# EAGLE schematic fp_32_v1 (EAGLE 8.4.1)

## Sheet 1 of 14
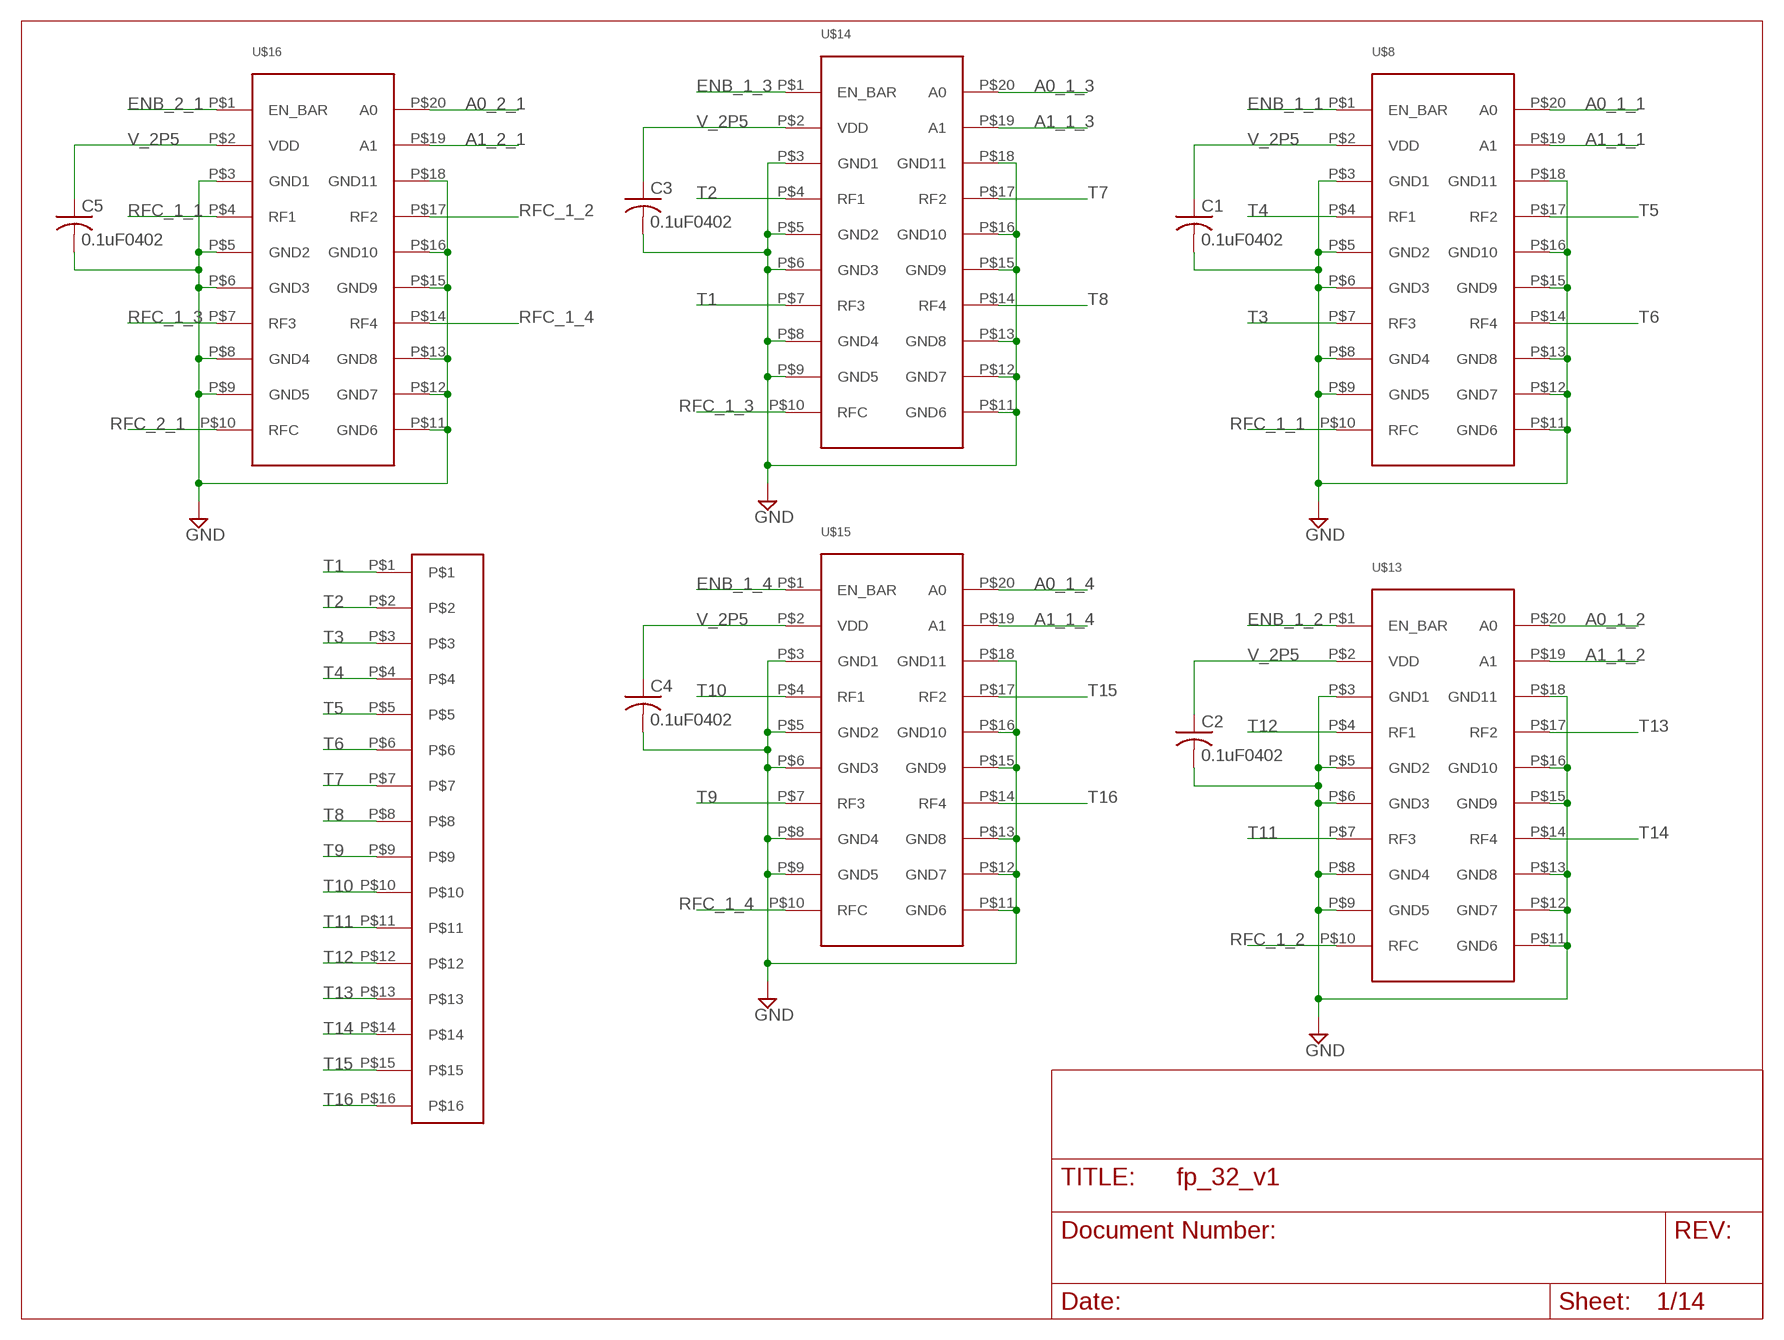
[diagram p0: schematic, sheet 1]

### Parts
C1  0.1uF0402  C-USC0402  [C0402]
C2  0.1uF0402  C-USC0402  [C0402]
C3  0.1uF0402  C-USC0402  [C0402]
C4  0.1uF0402  C-USC0402  [C0402]
C5  0.1uF0402  C-USC0402  [C0402]
U$2  FP-BOND-6MIL  [FP_BOND_6MIL]
U$8  TICLIB2_ADG904  [TICLIB2_ADG904_TSSOP]
U$13  TICLIB2_ADG904  [TICLIB2_ADG904_TSSOP]
U$14  TICLIB2_ADG904  [TICLIB2_ADG904_TSSOP]
U$15  TICLIB2_ADG904  [TICLIB2_ADG904_TSSOP]
U$16  TICLIB2_ADG904  [TICLIB2_ADG904_TSSOP]

### Nets
A0_1_1: U$8.P$20(A0) ; also sheet 5,6
A0_1_2: U$13.P$20(A0) ; also sheet 5,6
A0_1_3: U$14.P$20(A0) ; also sheet 5,6
A0_1_4: U$15.P$20(A0) ; also sheet 5,6
A0_2_1: U$16.P$20(A0) ; also sheet 6
A1_1_1: U$8.P$19(A1) ; also sheet 7
A1_1_2: U$13.P$19(A1) ; also sheet 7
A1_1_3: U$14.P$19(A1) ; also sheet 7
A1_1_4: U$15.P$19(A1) ; also sheet 7
A1_2_1: U$16.P$19(A1) ; also sheet 7
ENB_1_1: U$8.P$1(EN_BAR) ; also sheet 8
ENB_1_2: U$13.P$1(EN_BAR) ; also sheet 8
ENB_1_3: U$14.P$1(EN_BAR) ; also sheet 8
ENB_1_4: U$15.P$1(EN_BAR) ; also sheet 8
ENB_2_1: U$16.P$1(EN_BAR) ; also sheet 8
GND: C1.2 C2.2 C3.2 C4.2 C5.2 U$8.P$3(GND1) U$8.P$5(GND2) U$8.P$6(GND3) U$8.P$8(GND4) U$8.P$9(GND5) U$8.P$11(GND6) U$8.P$12(GND7) U$8.P$13(GND8) U$8.P$15(GND9) U$8.P$16(GND10) U$8.P$18(GND11) U$13.P$3(GND1) U$13.P$5(GND2) U$13.P$6(GND3) U$13.P$8(GND4) U$13.P$9(GND5) U$13.P$11(GND6) U$13.P$12(GND7) U$13.P$13(GND8) U$13.P$15(GND9) U$13.P$16(GND10) U$13.P$18(GND11) U$14.P$3(GND1) U$14.P$5(GND2) U$14.P$6(GND3) U$14.P$8(GND4) U$14.P$9(GND5) U$14.P$11(GND6) U$14.P$12(GND7) U$14.P$13(GND8) U$14.P$15(GND9) U$14.P$16(GND10) U$14.P$18(GND11) U$15.P$3(GND1) U$15.P$5(GND2) U$15.P$6(GND3) U$15.P$8(GND4) U$15.P$9(GND5) U$15.P$11(GND6) U$15.P$12(GND7) U$15.P$13(GND8) U$15.P$15(GND9) U$15.P$16(GND10) U$15.P$18(GND11) U$16.P$3(GND1) U$16.P$5(GND2) U$16.P$6(GND3) U$16.P$8(GND4) U$16.P$9(GND5) U$16.P$11(GND6) U$16.P$12(GND7) U$16.P$13(GND8) U$16.P$15(GND9) U$16.P$16(GND10) U$16.P$18(GND11) ; also sheet 2,3,4,5,6,7,8,9,10,11,12,13,14
RFC_1_1: U$8.P$10(RFC) U$16.P$4(RF1)
RFC_1_2: U$13.P$10(RFC) U$16.P$17(RF2)
RFC_1_3: U$14.P$10(RFC) U$16.P$7(RF3)
RFC_1_4: U$15.P$10(RFC) U$16.P$14(RF4)
RFC_2_1: U$16.P$10(RFC) ; also sheet 5
T1: U$2.P$1 U$14.P$7(RF3)
T2: U$2.P$2 U$14.P$4(RF1)
T3: U$2.P$3 U$8.P$7(RF3)
T4: U$2.P$4 U$8.P$4(RF1)
T5: U$2.P$5 U$8.P$17(RF2)
T6: U$2.P$6 U$8.P$14(RF4)
T7: U$2.P$7 U$14.P$17(RF2)
T8: U$2.P$8 U$14.P$14(RF4)
T9: U$2.P$9 U$15.P$7(RF3)
T10: U$2.P$10 U$15.P$4(RF1)
T11: U$2.P$11 U$13.P$7(RF3)
T12: U$2.P$12 U$13.P$4(RF1)
T13: U$2.P$13 U$13.P$17(RF2)
T14: U$2.P$14 U$13.P$14(RF4)
T15: U$2.P$15 U$15.P$17(RF2)
T16: U$2.P$16 U$15.P$14(RF4)
V_2P5: C1.1 C2.1 C3.1 C4.1 C5.1 U$8.P$2(VDD) U$13.P$2(VDD) U$14.P$2(VDD) U$15.P$2(VDD) U$16.P$2(VDD) ; also sheet 2,3,4,5,13

## Sheet 2 of 14
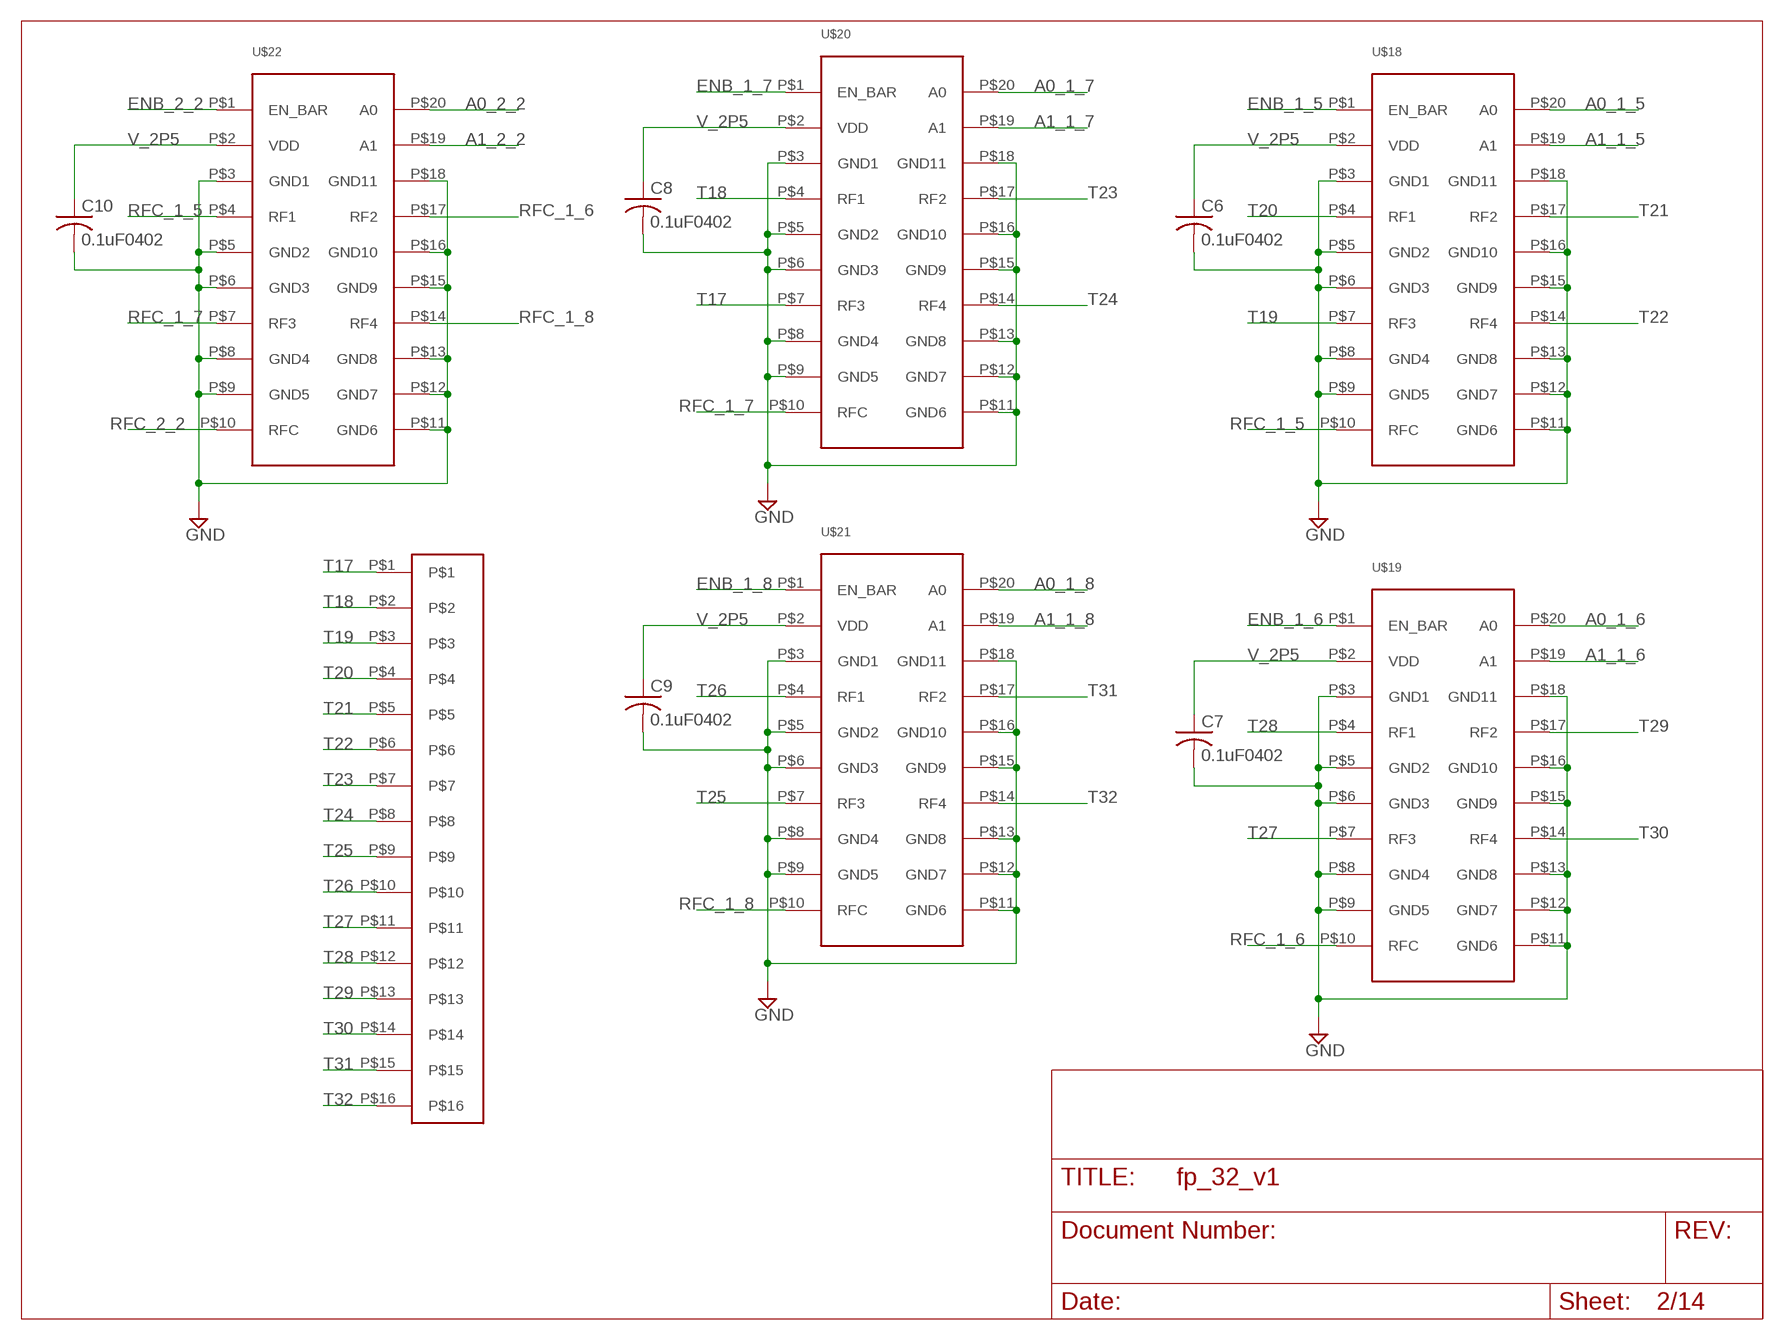
[diagram p1: schematic, sheet 2]

### Parts
C6  0.1uF0402  C-USC0402  [C0402]
C7  0.1uF0402  C-USC0402  [C0402]
C8  0.1uF0402  C-USC0402  [C0402]
C9  0.1uF0402  C-USC0402  [C0402]
C10  0.1uF0402  C-USC0402  [C0402]
U$17  FP-BOND-6MIL  [FP_BOND_6MIL]
U$18  TICLIB2_ADG904  [TICLIB2_ADG904_TSSOP]
U$19  TICLIB2_ADG904  [TICLIB2_ADG904_TSSOP]
U$20  TICLIB2_ADG904  [TICLIB2_ADG904_TSSOP]
U$21  TICLIB2_ADG904  [TICLIB2_ADG904_TSSOP]
U$22  TICLIB2_ADG904  [TICLIB2_ADG904_TSSOP]

### Nets
A0_1_5: U$18.P$20(A0) ; also sheet 5,6
A0_1_6: U$19.P$20(A0) ; also sheet 5,6
A0_1_7: U$20.P$20(A0) ; also sheet 5,6
A0_1_8: U$21.P$20(A0) ; also sheet 5,6
A0_2_2: U$22.P$20(A0) ; also sheet 6
A1_1_5: U$18.P$19(A1) ; also sheet 7
A1_1_6: U$19.P$19(A1) ; also sheet 7
A1_1_7: U$20.P$19(A1) ; also sheet 7
A1_1_8: U$21.P$19(A1) ; also sheet 7
A1_2_2: U$22.P$19(A1) ; also sheet 7
ENB_1_5: U$18.P$1(EN_BAR) ; also sheet 8
ENB_1_6: U$19.P$1(EN_BAR) ; also sheet 8
ENB_1_7: U$20.P$1(EN_BAR) ; also sheet 8
ENB_1_8: U$21.P$1(EN_BAR) ; also sheet 8
ENB_2_2: U$22.P$1(EN_BAR) ; also sheet 8
GND: C6.2 C7.2 C8.2 C9.2 C10.2 U$18.P$3(GND1) U$18.P$5(GND2) U$18.P$6(GND3) U$18.P$8(GND4) U$18.P$9(GND5) U$18.P$11(GND6) U$18.P$12(GND7) U$18.P$13(GND8) U$18.P$15(GND9) U$18.P$16(GND10) U$18.P$18(GND11) U$19.P$3(GND1) U$19.P$5(GND2) U$19.P$6(GND3) U$19.P$8(GND4) U$19.P$9(GND5) U$19.P$11(GND6) U$19.P$12(GND7) U$19.P$13(GND8) U$19.P$15(GND9) U$19.P$16(GND10) U$19.P$18(GND11) U$20.P$3(GND1) U$20.P$5(GND2) U$20.P$6(GND3) U$20.P$8(GND4) U$20.P$9(GND5) U$20.P$11(GND6) U$20.P$12(GND7) U$20.P$13(GND8) U$20.P$15(GND9) U$20.P$16(GND10) U$20.P$18(GND11) U$21.P$3(GND1) U$21.P$5(GND2) U$21.P$6(GND3) U$21.P$8(GND4) U$21.P$9(GND5) U$21.P$11(GND6) U$21.P$12(GND7) U$21.P$13(GND8) U$21.P$15(GND9) U$21.P$16(GND10) U$21.P$18(GND11) U$22.P$3(GND1) U$22.P$5(GND2) U$22.P$6(GND3) U$22.P$8(GND4) U$22.P$9(GND5) U$22.P$11(GND6) U$22.P$12(GND7) U$22.P$13(GND8) U$22.P$15(GND9) U$22.P$16(GND10) U$22.P$18(GND11) ; also sheet 1,3,4,5,6,7,8,9,10,11,12,13,14
RFC_1_5: U$18.P$10(RFC) U$22.P$4(RF1)
RFC_1_6: U$19.P$10(RFC) U$22.P$17(RF2)
RFC_1_7: U$20.P$10(RFC) U$22.P$7(RF3)
RFC_1_8: U$21.P$10(RFC) U$22.P$14(RF4)
RFC_2_2: U$22.P$10(RFC) ; also sheet 5
T17: U$17.P$1 U$20.P$7(RF3)
T18: U$17.P$2 U$20.P$4(RF1)
T19: U$17.P$3 U$18.P$7(RF3)
T20: U$17.P$4 U$18.P$4(RF1)
T21: U$17.P$5 U$18.P$17(RF2)
T22: U$17.P$6 U$18.P$14(RF4)
T23: U$17.P$7 U$20.P$17(RF2)
T24: U$17.P$8 U$20.P$14(RF4)
T25: U$17.P$9 U$21.P$7(RF3)
T26: U$17.P$10 U$21.P$4(RF1)
T27: U$17.P$11 U$19.P$7(RF3)
T28: U$17.P$12 U$19.P$4(RF1)
T29: U$17.P$13 U$19.P$17(RF2)
T30: U$17.P$14 U$19.P$14(RF4)
T31: U$17.P$15 U$21.P$17(RF2)
T32: U$17.P$16 U$21.P$14(RF4)
V_2P5: C6.1 C7.1 C8.1 C9.1 C10.1 U$18.P$2(VDD) U$19.P$2(VDD) U$20.P$2(VDD) U$21.P$2(VDD) U$22.P$2(VDD) ; also sheet 1,3,4,5,13

## Sheet 3 of 14
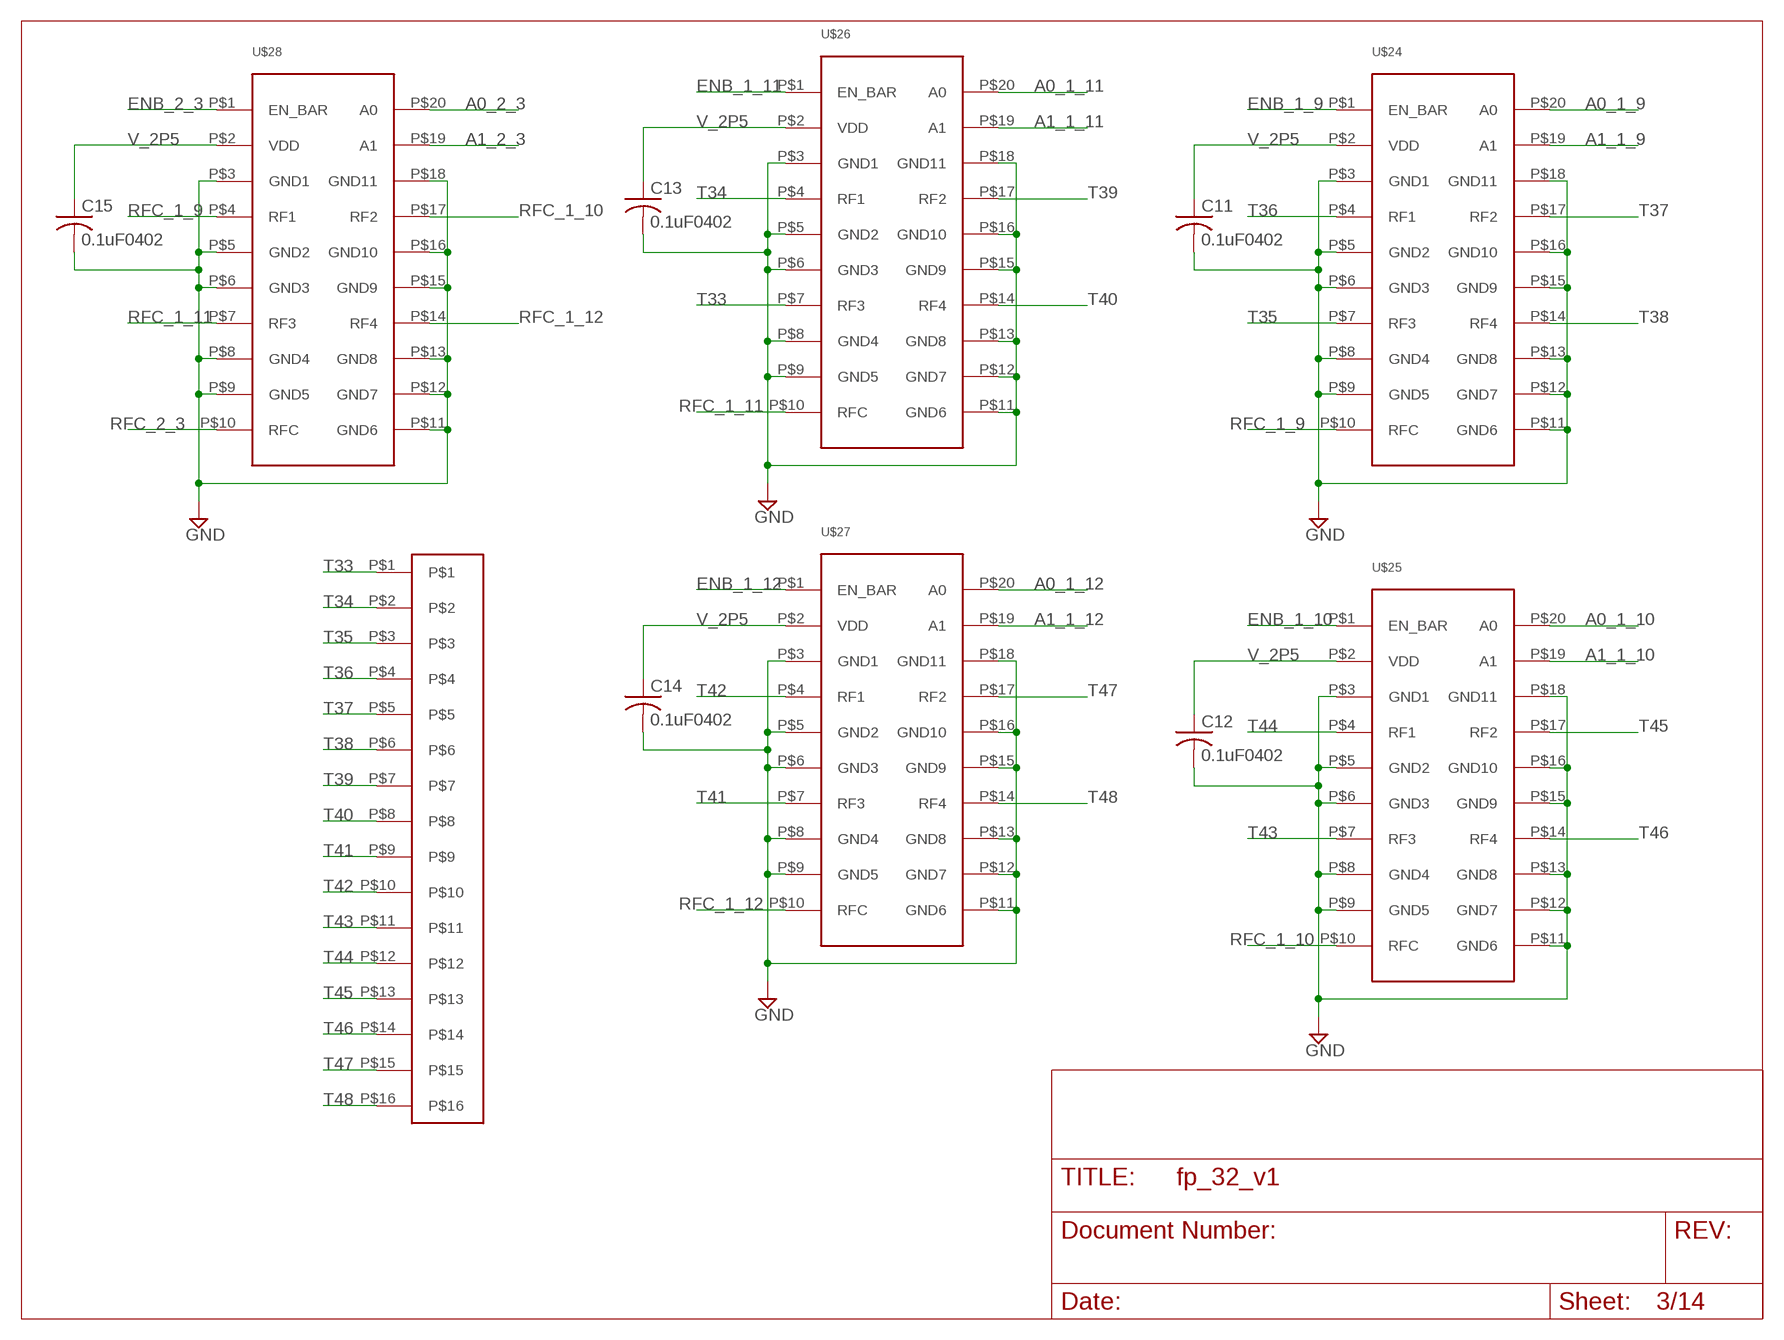
[diagram p2: schematic, sheet 3]

### Parts
C11  0.1uF0402  C-USC0402  [C0402]
C12  0.1uF0402  C-USC0402  [C0402]
C13  0.1uF0402  C-USC0402  [C0402]
C14  0.1uF0402  C-USC0402  [C0402]
C15  0.1uF0402  C-USC0402  [C0402]
U$23  FP-BOND-6MIL  [FP_BOND_6MIL]
U$24  TICLIB2_ADG904  [TICLIB2_ADG904_TSSOP]
U$25  TICLIB2_ADG904  [TICLIB2_ADG904_TSSOP]
U$26  TICLIB2_ADG904  [TICLIB2_ADG904_TSSOP]
U$27  TICLIB2_ADG904  [TICLIB2_ADG904_TSSOP]
U$28  TICLIB2_ADG904  [TICLIB2_ADG904_TSSOP]

### Nets
A0_1_9: U$24.P$20(A0) ; also sheet 5,6
A0_1_10: U$25.P$20(A0) ; also sheet 5,6
A0_1_11: U$26.P$20(A0) ; also sheet 5,6
A0_1_12: U$27.P$20(A0) ; also sheet 5,6
A0_2_3: U$28.P$20(A0) ; also sheet 6
A1_1_9: U$24.P$19(A1) ; also sheet 7
A1_1_10: U$25.P$19(A1) ; also sheet 7
A1_1_11: U$26.P$19(A1) ; also sheet 7
A1_1_12: U$27.P$19(A1) ; also sheet 7
A1_2_3: U$28.P$19(A1) ; also sheet 7
ENB_1_9: U$24.P$1(EN_BAR) ; also sheet 8
ENB_1_10: U$25.P$1(EN_BAR) ; also sheet 8
ENB_1_11: U$26.P$1(EN_BAR) ; also sheet 8
ENB_1_12: U$27.P$1(EN_BAR) ; also sheet 8
ENB_2_3: U$28.P$1(EN_BAR) ; also sheet 8
GND: C11.2 C12.2 C13.2 C14.2 C15.2 U$24.P$3(GND1) U$24.P$5(GND2) U$24.P$6(GND3) U$24.P$8(GND4) U$24.P$9(GND5) U$24.P$11(GND6) U$24.P$12(GND7) U$24.P$13(GND8) U$24.P$15(GND9) U$24.P$16(GND10) U$24.P$18(GND11) U$25.P$3(GND1) U$25.P$5(GND2) U$25.P$6(GND3) U$25.P$8(GND4) U$25.P$9(GND5) U$25.P$11(GND6) U$25.P$12(GND7) U$25.P$13(GND8) U$25.P$15(GND9) U$25.P$16(GND10) U$25.P$18(GND11) U$26.P$3(GND1) U$26.P$5(GND2) U$26.P$6(GND3) U$26.P$8(GND4) U$26.P$9(GND5) U$26.P$11(GND6) U$26.P$12(GND7) U$26.P$13(GND8) U$26.P$15(GND9) U$26.P$16(GND10) U$26.P$18(GND11) U$27.P$3(GND1) U$27.P$5(GND2) U$27.P$6(GND3) U$27.P$8(GND4) U$27.P$9(GND5) U$27.P$11(GND6) U$27.P$12(GND7) U$27.P$13(GND8) U$27.P$15(GND9) U$27.P$16(GND10) U$27.P$18(GND11) U$28.P$3(GND1) U$28.P$5(GND2) U$28.P$6(GND3) U$28.P$8(GND4) U$28.P$9(GND5) U$28.P$11(GND6) U$28.P$12(GND7) U$28.P$13(GND8) U$28.P$15(GND9) U$28.P$16(GND10) U$28.P$18(GND11) ; also sheet 1,2,4,5,6,7,8,9,10,11,12,13,14
RFC_1_9: U$24.P$10(RFC) U$28.P$4(RF1)
RFC_1_10: U$25.P$10(RFC) U$28.P$17(RF2)
RFC_1_11: U$26.P$10(RFC) U$28.P$7(RF3)
RFC_1_12: U$27.P$10(RFC) U$28.P$14(RF4)
RFC_2_3: U$28.P$10(RFC) ; also sheet 5
T33: U$23.P$1 U$26.P$7(RF3)
T34: U$23.P$2 U$26.P$4(RF1)
T35: U$23.P$3 U$24.P$7(RF3)
T36: U$23.P$4 U$24.P$4(RF1)
T37: U$23.P$5 U$24.P$17(RF2)
T38: U$23.P$6 U$24.P$14(RF4)
T39: U$23.P$7 U$26.P$17(RF2)
T40: U$23.P$8 U$26.P$14(RF4)
T41: U$23.P$9 U$27.P$7(RF3)
T42: U$23.P$10 U$27.P$4(RF1)
T43: U$23.P$11 U$25.P$7(RF3)
T44: U$23.P$12 U$25.P$4(RF1)
T45: U$23.P$13 U$25.P$17(RF2)
T46: U$23.P$14 U$25.P$14(RF4)
T47: U$23.P$15 U$27.P$17(RF2)
T48: U$23.P$16 U$27.P$14(RF4)
V_2P5: C11.1 C12.1 C13.1 C14.1 C15.1 U$24.P$2(VDD) U$25.P$2(VDD) U$26.P$2(VDD) U$27.P$2(VDD) U$28.P$2(VDD) ; also sheet 1,2,4,5,13

## Sheet 4 of 14
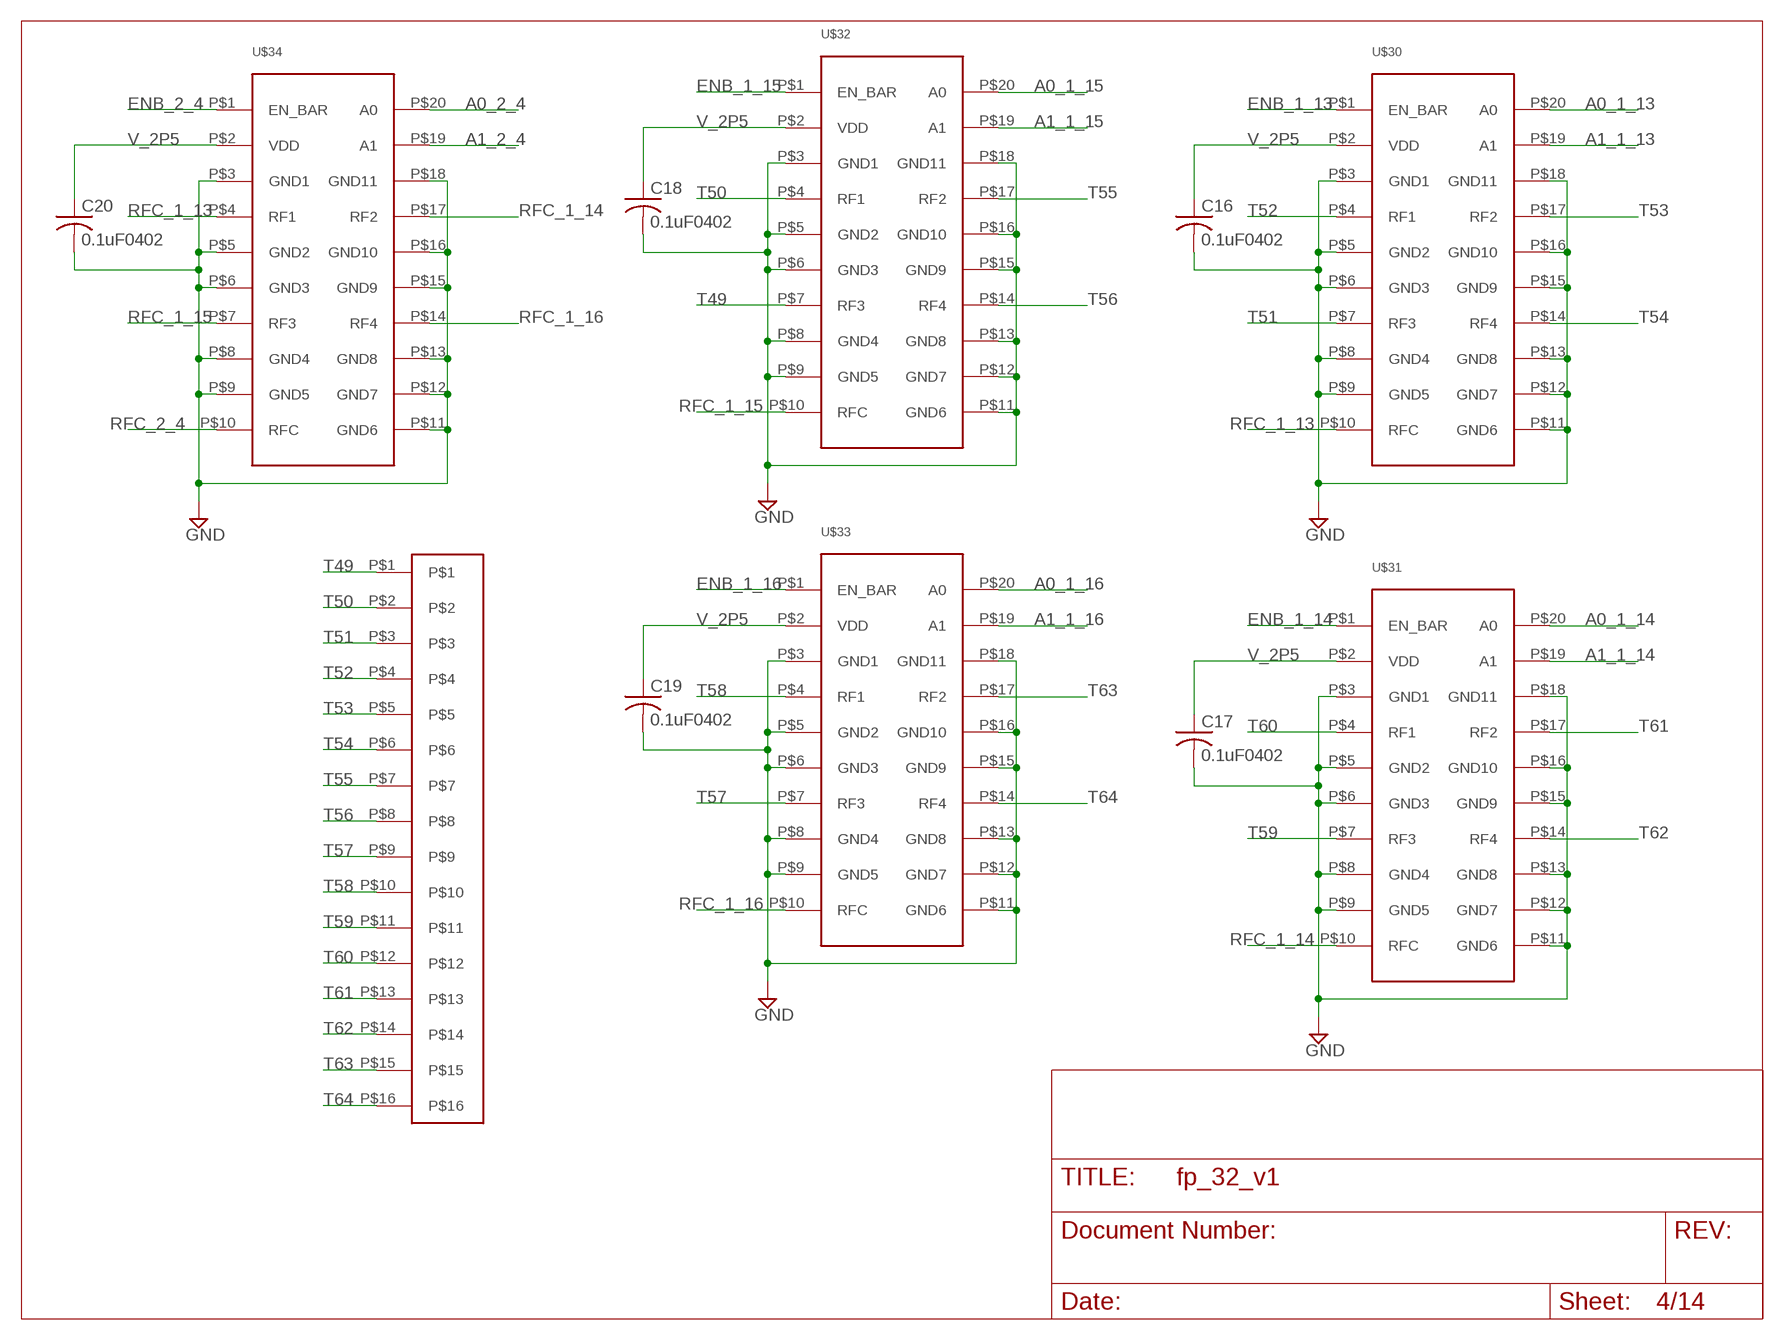
[diagram p3: schematic, sheet 4]

### Parts
C16  0.1uF0402  C-USC0402  [C0402]
C17  0.1uF0402  C-USC0402  [C0402]
C18  0.1uF0402  C-USC0402  [C0402]
C19  0.1uF0402  C-USC0402  [C0402]
C20  0.1uF0402  C-USC0402  [C0402]
U$29  FP-BOND-6MIL  [FP_BOND_6MIL]
U$30  TICLIB2_ADG904  [TICLIB2_ADG904_TSSOP]
U$31  TICLIB2_ADG904  [TICLIB2_ADG904_TSSOP]
U$32  TICLIB2_ADG904  [TICLIB2_ADG904_TSSOP]
U$33  TICLIB2_ADG904  [TICLIB2_ADG904_TSSOP]
U$34  TICLIB2_ADG904  [TICLIB2_ADG904_TSSOP]

### Nets
A0_1_13: U$30.P$20(A0) ; also sheet 5,6
A0_1_14: U$31.P$20(A0) ; also sheet 5,6
A0_1_15: U$32.P$20(A0) ; also sheet 5,6
A0_1_16: U$33.P$20(A0) ; also sheet 5,6
A0_2_4: U$34.P$20(A0) ; also sheet 6
A1_1_13: U$30.P$19(A1) ; also sheet 7
A1_1_14: U$31.P$19(A1) ; also sheet 7
A1_1_15: U$32.P$19(A1) ; also sheet 7
A1_1_16: U$33.P$19(A1) ; also sheet 7
A1_2_4: U$34.P$19(A1) ; also sheet 7
ENB_1_13: U$30.P$1(EN_BAR) ; also sheet 8
ENB_1_14: U$31.P$1(EN_BAR) ; also sheet 8
ENB_1_15: U$32.P$1(EN_BAR) ; also sheet 8
ENB_1_16: U$33.P$1(EN_BAR) ; also sheet 8
ENB_2_4: U$34.P$1(EN_BAR) ; also sheet 8
GND: C16.2 C17.2 C18.2 C19.2 C20.2 U$30.P$3(GND1) U$30.P$5(GND2) U$30.P$6(GND3) U$30.P$8(GND4) U$30.P$9(GND5) U$30.P$11(GND6) U$30.P$12(GND7) U$30.P$13(GND8) U$30.P$15(GND9) U$30.P$16(GND10) U$30.P$18(GND11) U$31.P$3(GND1) U$31.P$5(GND2) U$31.P$6(GND3) U$31.P$8(GND4) U$31.P$9(GND5) U$31.P$11(GND6) U$31.P$12(GND7) U$31.P$13(GND8) U$31.P$15(GND9) U$31.P$16(GND10) U$31.P$18(GND11) U$32.P$3(GND1) U$32.P$5(GND2) U$32.P$6(GND3) U$32.P$8(GND4) U$32.P$9(GND5) U$32.P$11(GND6) U$32.P$12(GND7) U$32.P$13(GND8) U$32.P$15(GND9) U$32.P$16(GND10) U$32.P$18(GND11) U$33.P$3(GND1) U$33.P$5(GND2) U$33.P$6(GND3) U$33.P$8(GND4) U$33.P$9(GND5) U$33.P$11(GND6) U$33.P$12(GND7) U$33.P$13(GND8) U$33.P$15(GND9) U$33.P$16(GND10) U$33.P$18(GND11) U$34.P$3(GND1) U$34.P$5(GND2) U$34.P$6(GND3) U$34.P$8(GND4) U$34.P$9(GND5) U$34.P$11(GND6) U$34.P$12(GND7) U$34.P$13(GND8) U$34.P$15(GND9) U$34.P$16(GND10) U$34.P$18(GND11) ; also sheet 1,2,3,5,6,7,8,9,10,11,12,13,14
RFC_1_13: U$30.P$10(RFC) U$34.P$4(RF1)
RFC_1_14: U$31.P$10(RFC) U$34.P$17(RF2)
RFC_1_15: U$32.P$10(RFC) U$34.P$7(RF3)
RFC_1_16: U$33.P$10(RFC) U$34.P$14(RF4)
RFC_2_4: U$34.P$10(RFC) ; also sheet 5
T49: U$29.P$1 U$32.P$7(RF3)
T50: U$29.P$2 U$32.P$4(RF1)
T51: U$29.P$3 U$30.P$7(RF3)
T52: U$29.P$4 U$30.P$4(RF1)
T53: U$29.P$5 U$30.P$17(RF2)
T54: U$29.P$6 U$30.P$14(RF4)
T55: U$29.P$7 U$32.P$17(RF2)
T56: U$29.P$8 U$32.P$14(RF4)
T57: U$29.P$9 U$33.P$7(RF3)
T58: U$29.P$10 U$33.P$4(RF1)
T59: U$29.P$11 U$31.P$7(RF3)
T60: U$29.P$12 U$31.P$4(RF1)
T61: U$29.P$13 U$31.P$17(RF2)
T62: U$29.P$14 U$31.P$14(RF4)
T63: U$29.P$15 U$33.P$17(RF2)
T64: U$29.P$16 U$33.P$14(RF4)
V_2P5: C16.1 C17.1 C18.1 C19.1 C20.1 U$30.P$2(VDD) U$31.P$2(VDD) U$32.P$2(VDD) U$33.P$2(VDD) U$34.P$2(VDD) ; also sheet 1,2,3,5,13

## Sheet 5 of 14
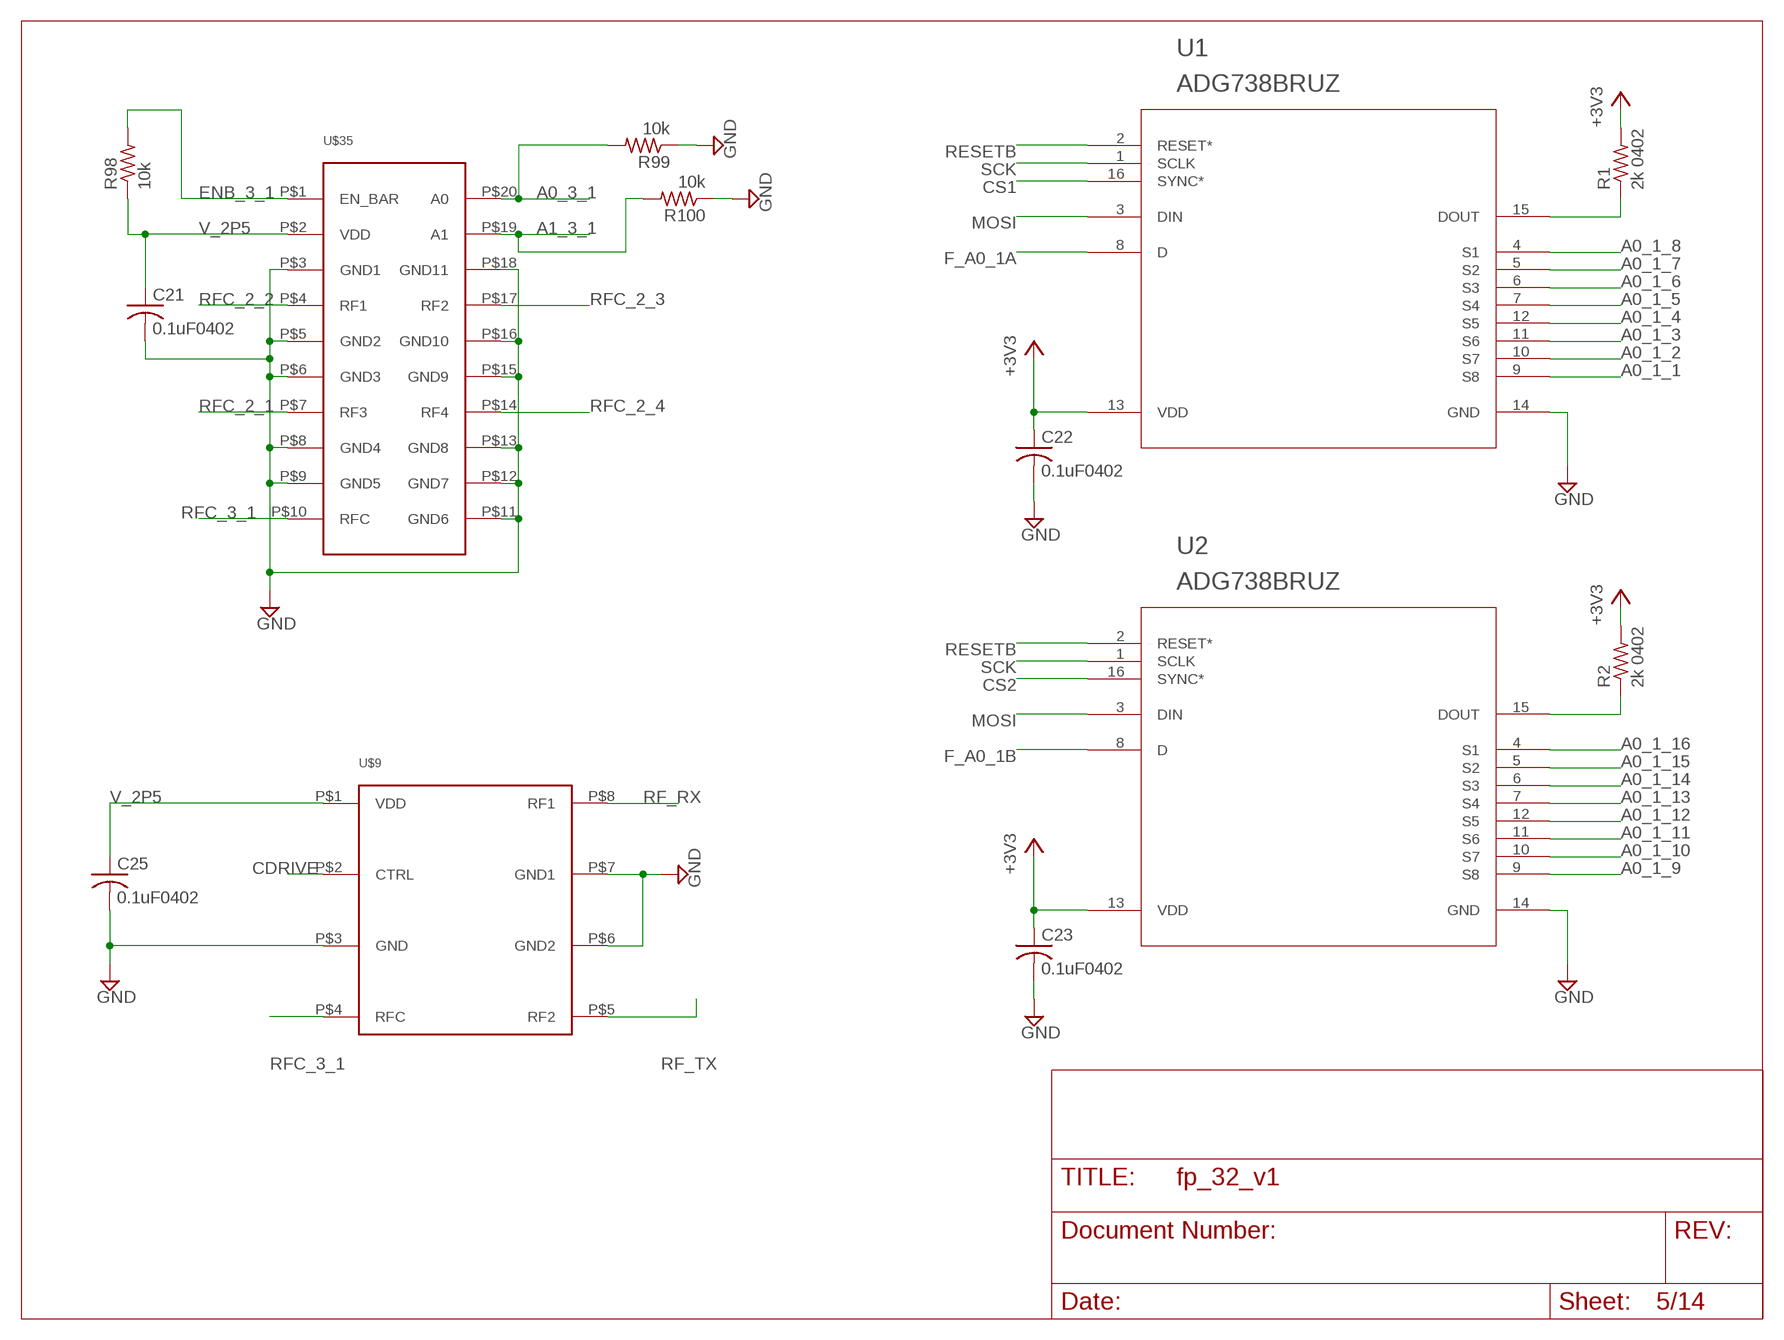
[diagram p4: schematic, sheet 5]

### Parts
C21  0.1uF0402  C-USC0402  [C0402]
C22  0.1uF0402  C-USC0402  [C0402]
C23  0.1uF0402  C-USC0402  [C0402]
C25  0.1uF0402  C-USC0402  [C0402]
R1  2k 0402  R-US_R0402  [R0402]
R2  2k 0402  R-US_R0402  [R0402]
R98  10k  R-US_R0402  [R0402]
R99  10k  R-US_R0402  [R0402]
R100  10k  R-US_R0402  [R0402]
U1  ADG738BRUZ  [RU_16]
U2  ADG738BRUZ  [RU_16]
U$9  TIC_TESTING_ADG918BRMZ-500RL7CT  [TIC_TESTING_ADG918BRMZ-500RL7CT-ND]
U$35  TICLIB2_ADG904  [TICLIB2_ADG904_TSSOP]

### Nets
+3V3: C22.1 C23.1 R1.2 R2.2 U1.13(VDD) U2.13(VDD) ; also sheet 6,7,8,13
A0_1_1: U1.9(S8) ; also sheet 1,6
A0_1_2: U1.10(S7) ; also sheet 1,6
A0_1_3: U1.11(S6) ; also sheet 1,6
A0_1_4: U1.12(S5) ; also sheet 1,6
A0_1_5: U1.7(S4) ; also sheet 2,6
A0_1_6: U1.6(S3) ; also sheet 2,6
A0_1_7: U1.5(S2) ; also sheet 2,6
A0_1_8: U1.4(S1) ; also sheet 2,6
A0_1_9: U2.9(S8) ; also sheet 3,6
A0_1_10: U2.10(S7) ; also sheet 3,6
A0_1_11: U2.11(S6) ; also sheet 3,6
A0_1_12: U2.12(S5) ; also sheet 3,6
A0_1_13: U2.7(S4) ; also sheet 4,6
A0_1_14: U2.6(S3) ; also sheet 4,6
A0_1_15: U2.5(S2) ; also sheet 4,6
A0_1_16: U2.4(S1) ; also sheet 4,6
A0_3_1: R99.2 U$35.P$20(A0) ; also sheet 14
A1_3_1: R100.2 U$35.P$19(A1) ; also sheet 14
CDRIVE: U$9.P$2(CTRL) ; also sheet 14
CS1: U1.16(SYNC*) ; also sheet 14
CS2: U2.16(SYNC*) ; also sheet 14
ENB_3_1: R98.2 U$35.P$1(EN_BAR) ; also sheet 14
F_A0_1A: U1.8(D) ; also sheet 14
F_A0_1B: U2.8(D) ; also sheet 14
GND: C21.2 C22.2 C23.2 C25.2 R99.1 R100.1 U1.14(GND) U2.14(GND) U$9.P$3(GND) U$9.P$6(GND2) U$9.P$7(GND1) U$35.P$3(GND1) U$35.P$5(GND2) U$35.P$6(GND3) U$35.P$8(GND4) U$35.P$9(GND5) U$35.P$11(GND6) U$35.P$12(GND7) U$35.P$13(GND8) U$35.P$15(GND9) U$35.P$16(GND10) U$35.P$18(GND11) ; also sheet 1,2,3,4,6,7,8,9,10,11,12,13,14
MOSI: U1.3(DIN) U2.3(DIN) ; also sheet 6,7,8,14
N$1: R1.1 U1.15(DOUT)
N$2: R2.1 U2.15(DOUT)
RESETB: U1.2(RESET*) U2.2(RESET*) ; also sheet 6,7,8,14
RF_RX: U$9.P$8(RF1) ; also sheet 6
RF_TX: U$9.P$5(RF2) ; also sheet 11
RFC_2_1: U$35.P$7(RF3) ; also sheet 1
RFC_2_2: U$35.P$4(RF1) ; also sheet 2
RFC_2_3: U$35.P$17(RF2) ; also sheet 3
RFC_2_4: U$35.P$14(RF4) ; also sheet 4
RFC_3_1: U$9.P$4(RFC) U$35.P$10(RFC)
SCK: U1.1(SCLK) U2.1(SCLK) ; also sheet 6,7,8,14
V_2P5: C21.1 C25.1 R98.1 U$9.P$1(VDD) U$35.P$2(VDD) ; also sheet 1,2,3,4,13

## Sheet 6 of 14
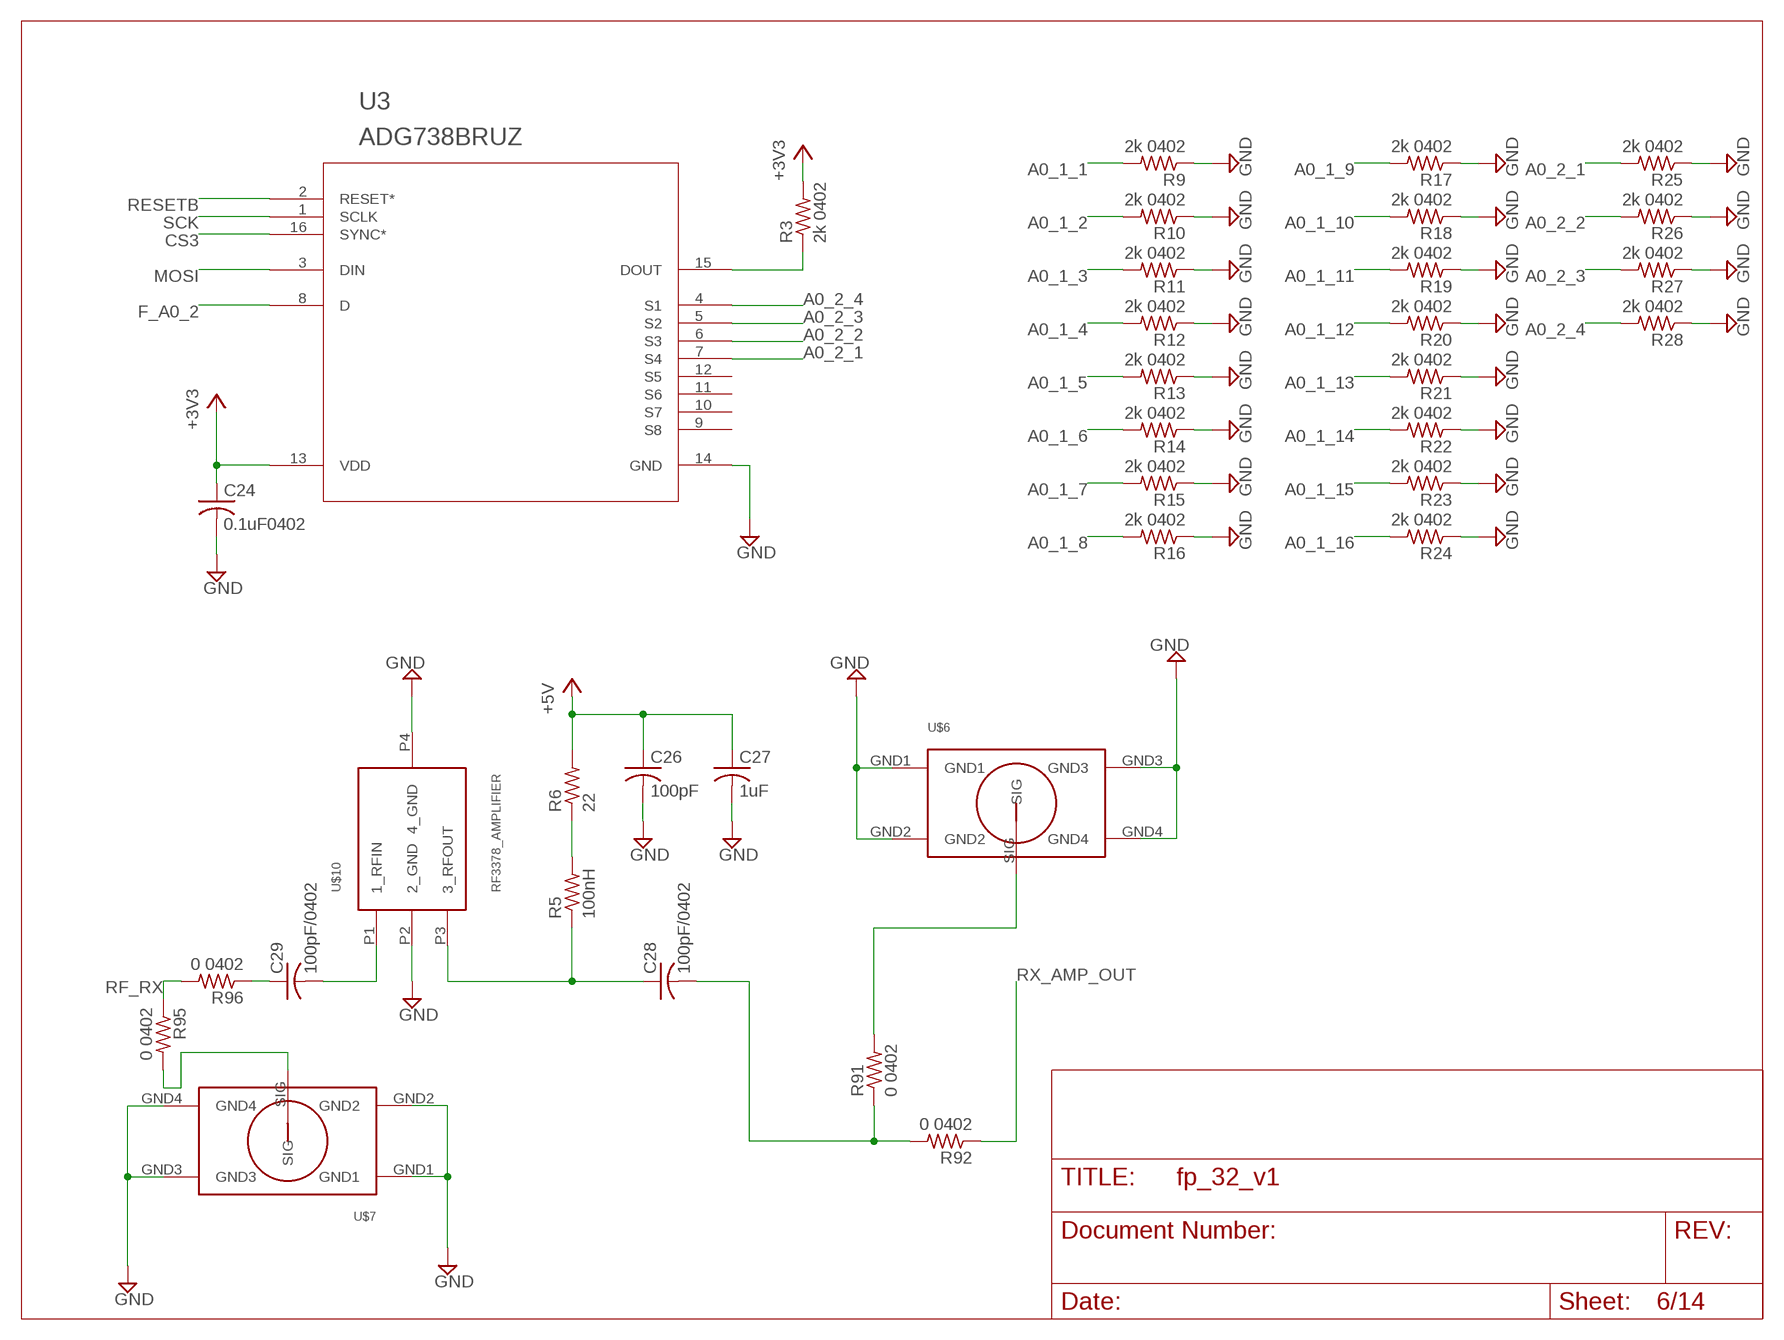
[diagram p5: schematic, sheet 6]

### Parts
C24  0.1uF0402  C-USC0402  [C0402]
C26  100pF  C-USC0603  [C0603]
C27  1uF  C-USC0603  [C0603]
C28  100pF/0402  C-USC0402  [C0402]
C29  100pF/0402  C-USC0402  [C0402]
R3  2k 0402  R-US_R0402  [R0402]
R5  100nH  R-US_R0603  [R0603]
R6  22  R-US_R0805  [R0805]
R9  2k 0402  R-US_R0402  [R0402]
R10  2k 0402  R-US_R0402  [R0402]
R11  2k 0402  R-US_R0402  [R0402]
R12  2k 0402  R-US_R0402  [R0402]
R13  2k 0402  R-US_R0402  [R0402]
R14  2k 0402  R-US_R0402  [R0402]
R15  2k 0402  R-US_R0402  [R0402]
R16  2k 0402  R-US_R0402  [R0402]
R17  2k 0402  R-US_R0402  [R0402]
R18  2k 0402  R-US_R0402  [R0402]
R19  2k 0402  R-US_R0402  [R0402]
R20  2k 0402  R-US_R0402  [R0402]
R21  2k 0402  R-US_R0402  [R0402]
R22  2k 0402  R-US_R0402  [R0402]
R23  2k 0402  R-US_R0402  [R0402]
R24  2k 0402  R-US_R0402  [R0402]
R25  2k 0402  R-US_R0402  [R0402]
R26  2k 0402  R-US_R0402  [R0402]
R27  2k 0402  R-US_R0402  [R0402]
R28  2k 0402  R-US_R0402  [R0402]
R91  0 0402  R-US_R0402  [R0402]
R92  0 0402  R-US_R0402  [R0402]
R95  0 0402  R-US_R0402  [R0402]
R96  0 0402  R-US_R0402  [R0402]
U3  ADG738BRUZ  [RU_16]
U$6  MINISMP_PE44970_THRUHOLE  [MINISMP_PE44970_THRU_HOLE]
U$7  MINISMP_PE44970_THRUHOLE  [MINISMP_PE44970_THRU_HOLE]
U$10  RF3378_AMPLIFIER  [TO243AA/SOT89]

### Nets
+3V3: C24.1 R3.2 U3.13(VDD) ; also sheet 5,7,8,13
+5V: C26.1 C27.1 R6.2 ; also sheet 10,11,12,13
A0_1_1: R9.2 ; also sheet 1,5
A0_1_2: R10.2 ; also sheet 1,5
A0_1_3: R11.2 ; also sheet 1,5
A0_1_4: R12.2 ; also sheet 1,5
A0_1_5: R13.2 ; also sheet 2,5
A0_1_6: R14.2 ; also sheet 2,5
A0_1_7: R15.2 ; also sheet 2,5
A0_1_8: R16.2 ; also sheet 2,5
A0_1_9: R17.2 ; also sheet 3,5
A0_1_10: R18.2 ; also sheet 3,5
A0_1_11: R19.2 ; also sheet 3,5
A0_1_12: R20.2 ; also sheet 3,5
A0_1_13: R21.2 ; also sheet 4,5
A0_1_14: R22.2 ; also sheet 4,5
A0_1_15: R23.2 ; also sheet 4,5
A0_1_16: R24.2 ; also sheet 4,5
A0_2_1: R25.2 U3.7(S4) ; also sheet 1
A0_2_2: R26.2 U3.6(S3) ; also sheet 2
A0_2_3: R27.2 U3.5(S2) ; also sheet 3
A0_2_4: R28.2 U3.4(S1) ; also sheet 4
CS3: U3.16(SYNC*) ; also sheet 14
F_A0_2: U3.8(D) ; also sheet 14
GND: C24.2 C26.2 C27.2 R9.1 R10.1 R11.1 R12.1 R13.1 R14.1 R15.1 R16.1 R17.1 R18.1 R19.1 R20.1 R21.1 R22.1 R23.1 R24.1 R25.1 R26.1 R27.1 R28.1 U3.14(GND) U$6.GND1 U$6.GND2 U$6.GND3 U$6.GND4 U$7.GND1 U$7.GND2 U$7.GND3 U$7.GND4 U$10.P2(2_GND) U$10.P4(4_GND) ; also sheet 1,2,3,4,5,7,8,9,10,11,12,13,14
MOSI: U3.3(DIN) ; also sheet 5,7,8,14
N$4: R3.1 U3.15(DOUT)
N$5: C28.1 R5.1 U$10.P3(3_RFOUT)
N$6: R5.2 R6.1
N$7: C29.2 U$10.P1(1_RFIN)
N$9: C28.2 R91.1 R92.2
N$18: R91.2 U$6.SIG
N$33: R95.2 U$7.SIG
N$42: C29.1 R96.1
RESETB: U3.2(RESET*) ; also sheet 5,7,8,14
RF_RX: R95.1 R96.2 ; also sheet 5
RX_AMP_OUT: R92.1 ; also sheet 12
SCK: U3.1(SCLK) ; also sheet 5,7,8,14
Unconnected: U3.9(S8) U3.10(S7) U3.11(S6) U3.12(S5)

## Sheet 7 of 14
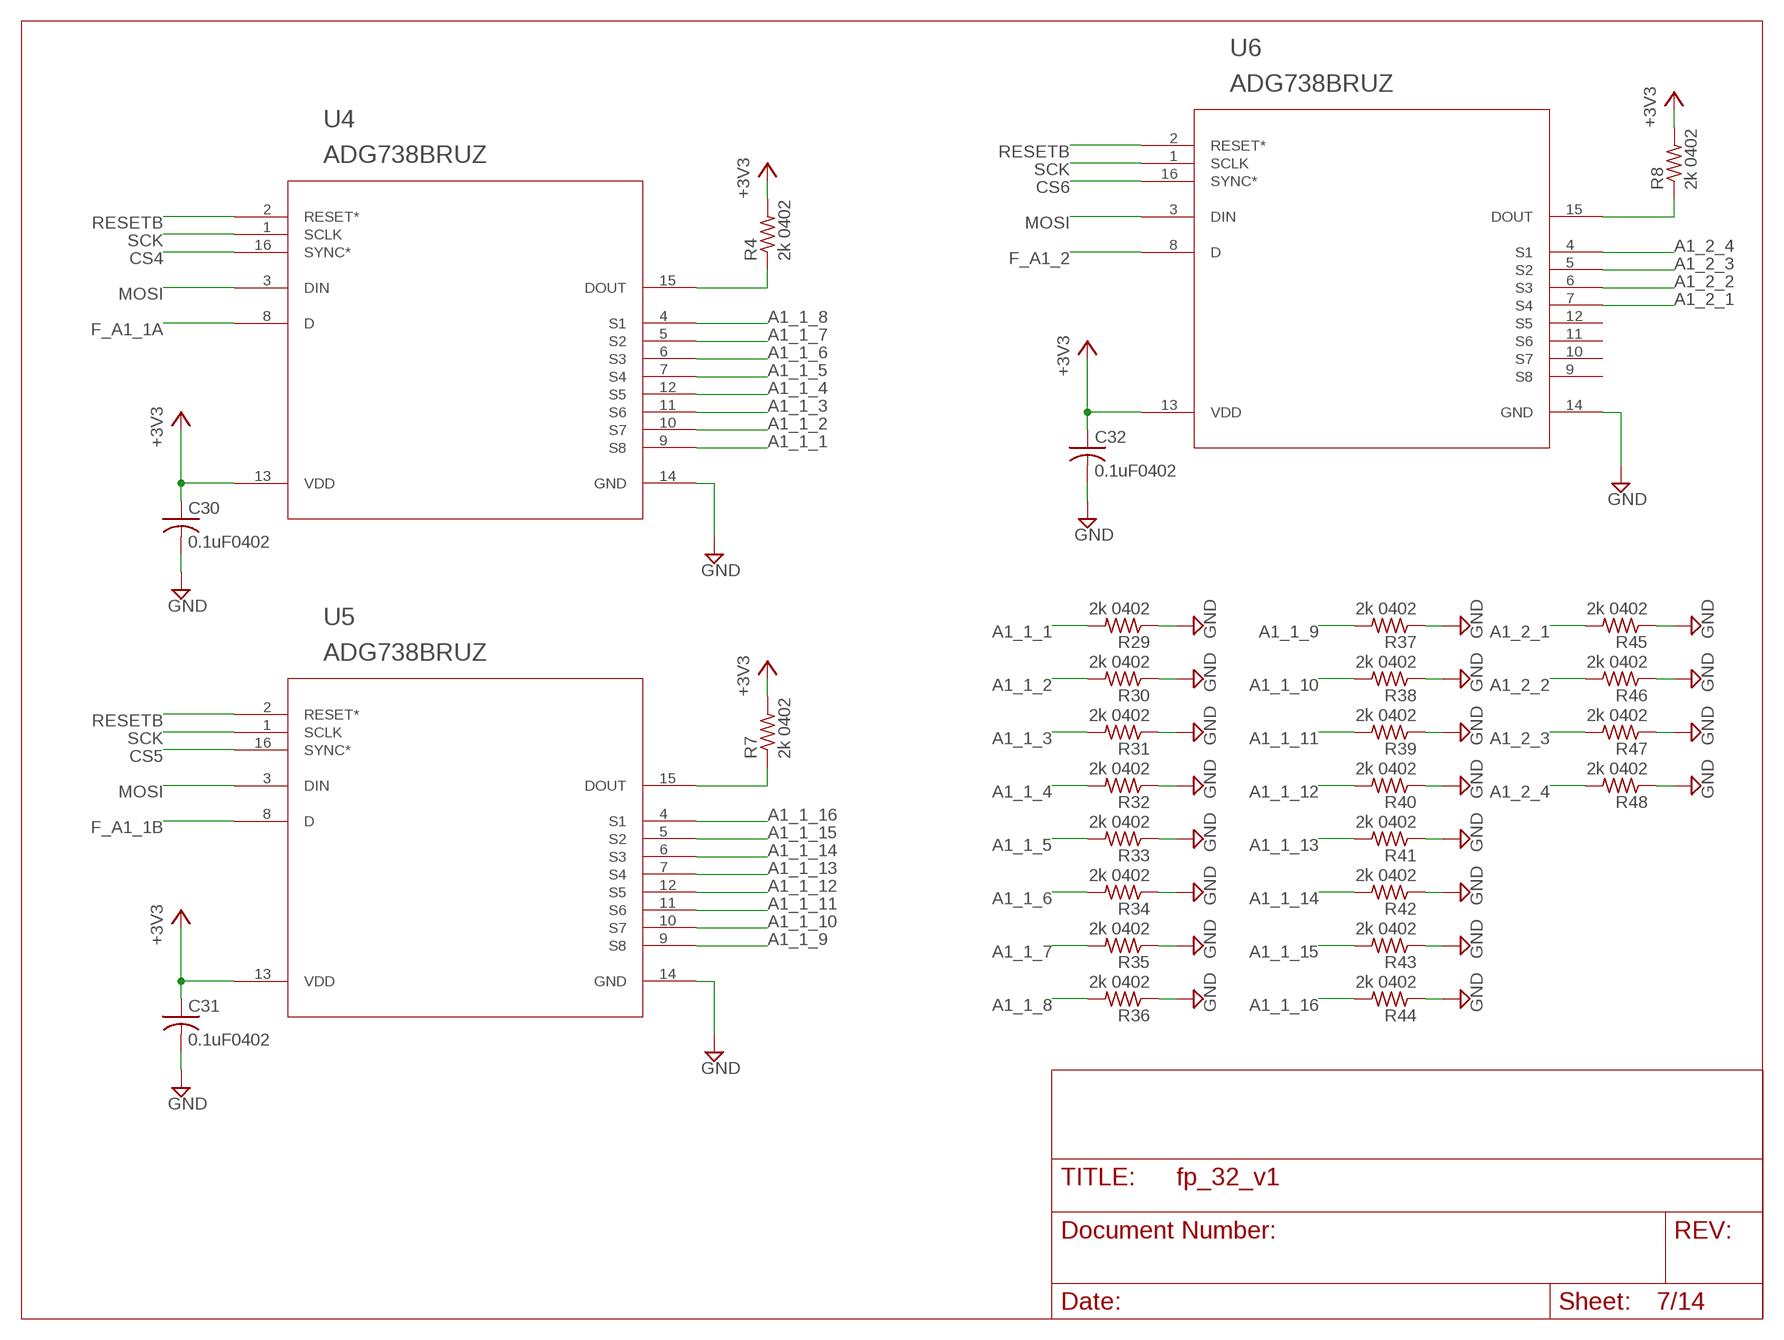
[diagram p6: schematic, sheet 7]

### Parts
C30  0.1uF0402  C-USC0402  [C0402]
C31  0.1uF0402  C-USC0402  [C0402]
C32  0.1uF0402  C-USC0402  [C0402]
R4  2k 0402  R-US_R0402  [R0402]
R7  2k 0402  R-US_R0402  [R0402]
R8  2k 0402  R-US_R0402  [R0402]
R29  2k 0402  R-US_R0402  [R0402]
R30  2k 0402  R-US_R0402  [R0402]
R31  2k 0402  R-US_R0402  [R0402]
R32  2k 0402  R-US_R0402  [R0402]
R33  2k 0402  R-US_R0402  [R0402]
R34  2k 0402  R-US_R0402  [R0402]
R35  2k 0402  R-US_R0402  [R0402]
R36  2k 0402  R-US_R0402  [R0402]
R37  2k 0402  R-US_R0402  [R0402]
R38  2k 0402  R-US_R0402  [R0402]
R39  2k 0402  R-US_R0402  [R0402]
R40  2k 0402  R-US_R0402  [R0402]
R41  2k 0402  R-US_R0402  [R0402]
R42  2k 0402  R-US_R0402  [R0402]
R43  2k 0402  R-US_R0402  [R0402]
R44  2k 0402  R-US_R0402  [R0402]
R45  2k 0402  R-US_R0402  [R0402]
R46  2k 0402  R-US_R0402  [R0402]
R47  2k 0402  R-US_R0402  [R0402]
R48  2k 0402  R-US_R0402  [R0402]
U4  ADG738BRUZ  [RU_16]
U5  ADG738BRUZ  [RU_16]
U6  ADG738BRUZ  [RU_16]

### Nets
+3V3: C30.1 C31.1 C32.1 R4.2 R7.2 R8.2 U4.13(VDD) U5.13(VDD) U6.13(VDD) ; also sheet 5,6,8,13
A1_1_1: R29.2 U4.9(S8) ; also sheet 1
A1_1_2: R30.2 U4.10(S7) ; also sheet 1
A1_1_3: R31.2 U4.11(S6) ; also sheet 1
A1_1_4: R32.2 U4.12(S5) ; also sheet 1
A1_1_5: R33.2 U4.7(S4) ; also sheet 2
A1_1_6: R34.2 U4.6(S3) ; also sheet 2
A1_1_7: R35.2 U4.5(S2) ; also sheet 2
A1_1_8: R36.2 U4.4(S1) ; also sheet 2
A1_1_9: R37.2 U5.9(S8) ; also sheet 3
A1_1_10: R38.2 U5.10(S7) ; also sheet 3
A1_1_11: R39.2 U5.11(S6) ; also sheet 3
A1_1_12: R40.2 U5.12(S5) ; also sheet 3
A1_1_13: R41.2 U5.7(S4) ; also sheet 4
A1_1_14: R42.2 U5.6(S3) ; also sheet 4
A1_1_15: R43.2 U5.5(S2) ; also sheet 4
A1_1_16: R44.2 U5.4(S1) ; also sheet 4
A1_2_1: R45.2 U6.7(S4) ; also sheet 1
A1_2_2: R46.2 U6.6(S3) ; also sheet 2
A1_2_3: R47.2 U6.5(S2) ; also sheet 3
A1_2_4: R48.2 U6.4(S1) ; also sheet 4
CS4: U4.16(SYNC*) ; also sheet 14
CS5: U5.16(SYNC*) ; also sheet 14
CS6: U6.16(SYNC*) ; also sheet 14
F_A1_1A: U4.8(D) ; also sheet 14
F_A1_1B: U5.8(D) ; also sheet 14
F_A1_2: U6.8(D) ; also sheet 14
GND: C30.2 C31.2 C32.2 R29.1 R30.1 R31.1 R32.1 R33.1 R34.1 R35.1 R36.1 R37.1 R38.1 R39.1 R40.1 R41.1 R42.1 R43.1 R44.1 R45.1 R46.1 R47.1 R48.1 U4.14(GND) U5.14(GND) U6.14(GND) ; also sheet 1,2,3,4,5,6,8,9,10,11,12,13,14
MOSI: U4.3(DIN) U5.3(DIN) U6.3(DIN) ; also sheet 5,6,8,14
N$10: R4.1 U4.15(DOUT)
N$11: R7.1 U5.15(DOUT)
N$12: R8.1 U6.15(DOUT)
RESETB: U4.2(RESET*) U5.2(RESET*) U6.2(RESET*) ; also sheet 5,6,8,14
SCK: U4.1(SCLK) U5.1(SCLK) U6.1(SCLK) ; also sheet 5,6,8,14
Unconnected: U6.9(S8) U6.10(S7) U6.11(S6) U6.12(S5)

## Sheet 8 of 14
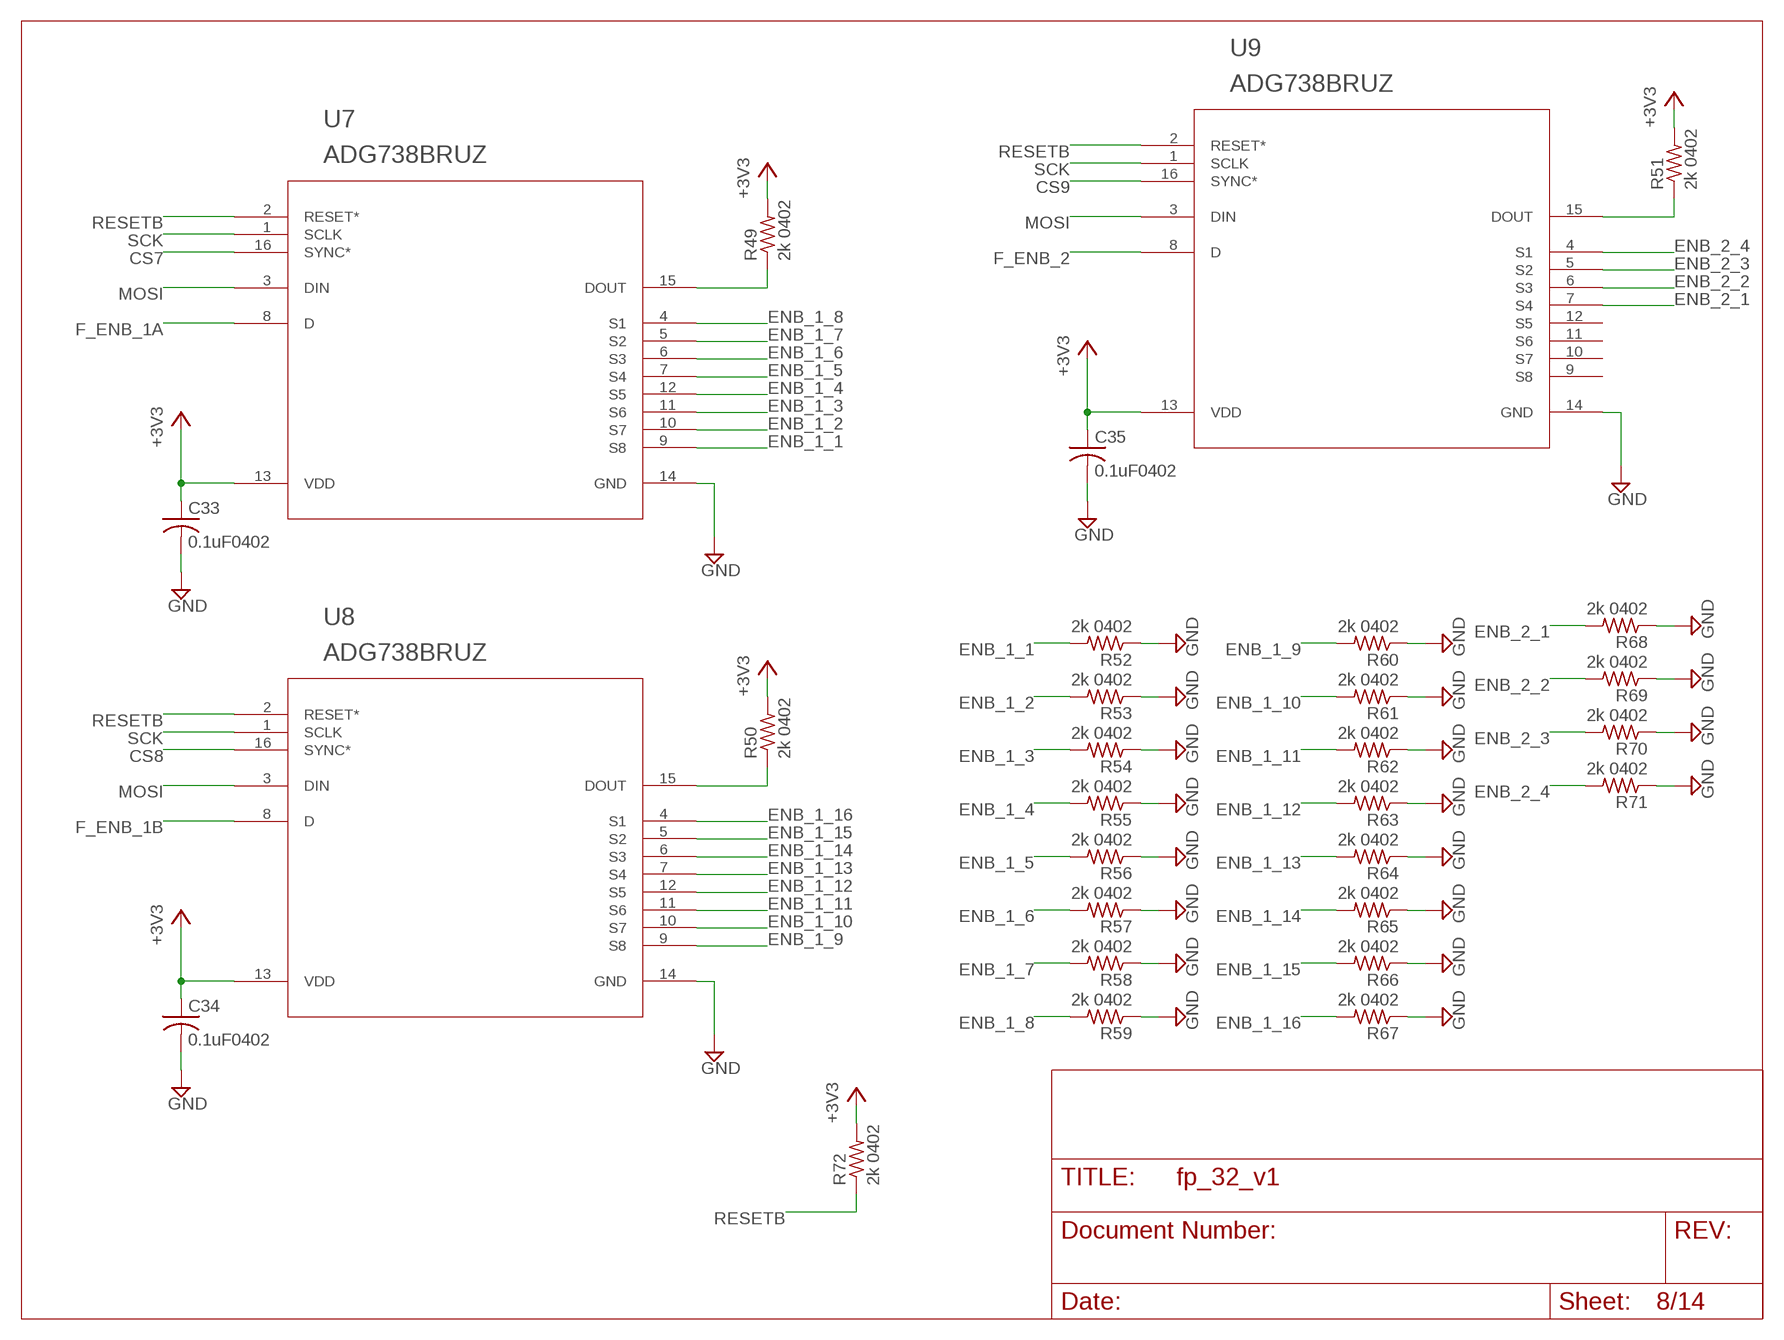
[diagram p7: schematic, sheet 8]

### Parts
C33  0.1uF0402  C-USC0402  [C0402]
C34  0.1uF0402  C-USC0402  [C0402]
C35  0.1uF0402  C-USC0402  [C0402]
R49  2k 0402  R-US_R0402  [R0402]
R50  2k 0402  R-US_R0402  [R0402]
R51  2k 0402  R-US_R0402  [R0402]
R52  2k 0402  R-US_R0402  [R0402]
R53  2k 0402  R-US_R0402  [R0402]
R54  2k 0402  R-US_R0402  [R0402]
R55  2k 0402  R-US_R0402  [R0402]
R56  2k 0402  R-US_R0402  [R0402]
R57  2k 0402  R-US_R0402  [R0402]
R58  2k 0402  R-US_R0402  [R0402]
R59  2k 0402  R-US_R0402  [R0402]
R60  2k 0402  R-US_R0402  [R0402]
R61  2k 0402  R-US_R0402  [R0402]
R62  2k 0402  R-US_R0402  [R0402]
R63  2k 0402  R-US_R0402  [R0402]
R64  2k 0402  R-US_R0402  [R0402]
R65  2k 0402  R-US_R0402  [R0402]
R66  2k 0402  R-US_R0402  [R0402]
R67  2k 0402  R-US_R0402  [R0402]
R68  2k 0402  R-US_R0402  [R0402]
R69  2k 0402  R-US_R0402  [R0402]
R70  2k 0402  R-US_R0402  [R0402]
R71  2k 0402  R-US_R0402  [R0402]
R72  2k 0402  R-US_R0402  [R0402]
U7  ADG738BRUZ  [RU_16]
U8  ADG738BRUZ  [RU_16]
U9  ADG738BRUZ  [RU_16]

### Nets
+3V3: C33.1 C34.1 C35.1 R49.2 R50.2 R51.2 R72.2 U7.13(VDD) U8.13(VDD) U9.13(VDD) ; also sheet 5,6,7,13
CS7: U7.16(SYNC*) ; also sheet 14
CS8: U8.16(SYNC*) ; also sheet 14
CS9: U9.16(SYNC*) ; also sheet 14
ENB_1_1: R52.2 U7.9(S8) ; also sheet 1
ENB_1_2: R53.2 U7.10(S7) ; also sheet 1
ENB_1_3: R54.2 U7.11(S6) ; also sheet 1
ENB_1_4: R55.2 U7.12(S5) ; also sheet 1
ENB_1_5: R56.2 U7.7(S4) ; also sheet 2
ENB_1_6: R57.2 U7.6(S3) ; also sheet 2
ENB_1_7: R58.2 U7.5(S2) ; also sheet 2
ENB_1_8: R59.2 U7.4(S1) ; also sheet 2
ENB_1_9: R60.2 U8.9(S8) ; also sheet 3
ENB_1_10: R61.2 U8.10(S7) ; also sheet 3
ENB_1_11: R62.2 U8.11(S6) ; also sheet 3
ENB_1_12: R63.2 U8.12(S5) ; also sheet 3
ENB_1_13: R64.2 U8.7(S4) ; also sheet 4
ENB_1_14: R65.2 U8.6(S3) ; also sheet 4
ENB_1_15: R66.2 U8.5(S2) ; also sheet 4
ENB_1_16: R67.2 U8.4(S1) ; also sheet 4
ENB_2_1: R68.2 U9.7(S4) ; also sheet 1
ENB_2_2: R69.2 U9.6(S3) ; also sheet 2
ENB_2_3: R70.2 U9.5(S2) ; also sheet 3
ENB_2_4: R71.2 U9.4(S1) ; also sheet 4
F_ENB_1A: U7.8(D) ; also sheet 14
F_ENB_1B: U8.8(D) ; also sheet 14
F_ENB_2: U9.8(D) ; also sheet 14
GND: C33.2 C34.2 C35.2 R52.1 R53.1 R54.1 R55.1 R56.1 R57.1 R58.1 R59.1 R60.1 R61.1 R62.1 R63.1 R64.1 R65.1 R66.1 R67.1 R68.1 R69.1 R70.1 R71.1 U7.14(GND) U8.14(GND) U9.14(GND) ; also sheet 1,2,3,4,5,6,7,9,10,11,12,13,14
MOSI: U7.3(DIN) U8.3(DIN) U9.3(DIN) ; also sheet 5,6,7,14
N$13: R49.1 U7.15(DOUT)
N$14: R50.1 U8.15(DOUT)
N$15: R51.1 U9.15(DOUT)
RESETB: R72.1 U7.2(RESET*) U8.2(RESET*) U9.2(RESET*) ; also sheet 5,6,7,14
SCK: U7.1(SCLK) U8.1(SCLK) U9.1(SCLK) ; also sheet 5,6,7,14
Unconnected: U9.9(S8) U9.10(S7) U9.11(S6) U9.12(S5)

## Sheet 9 of 14
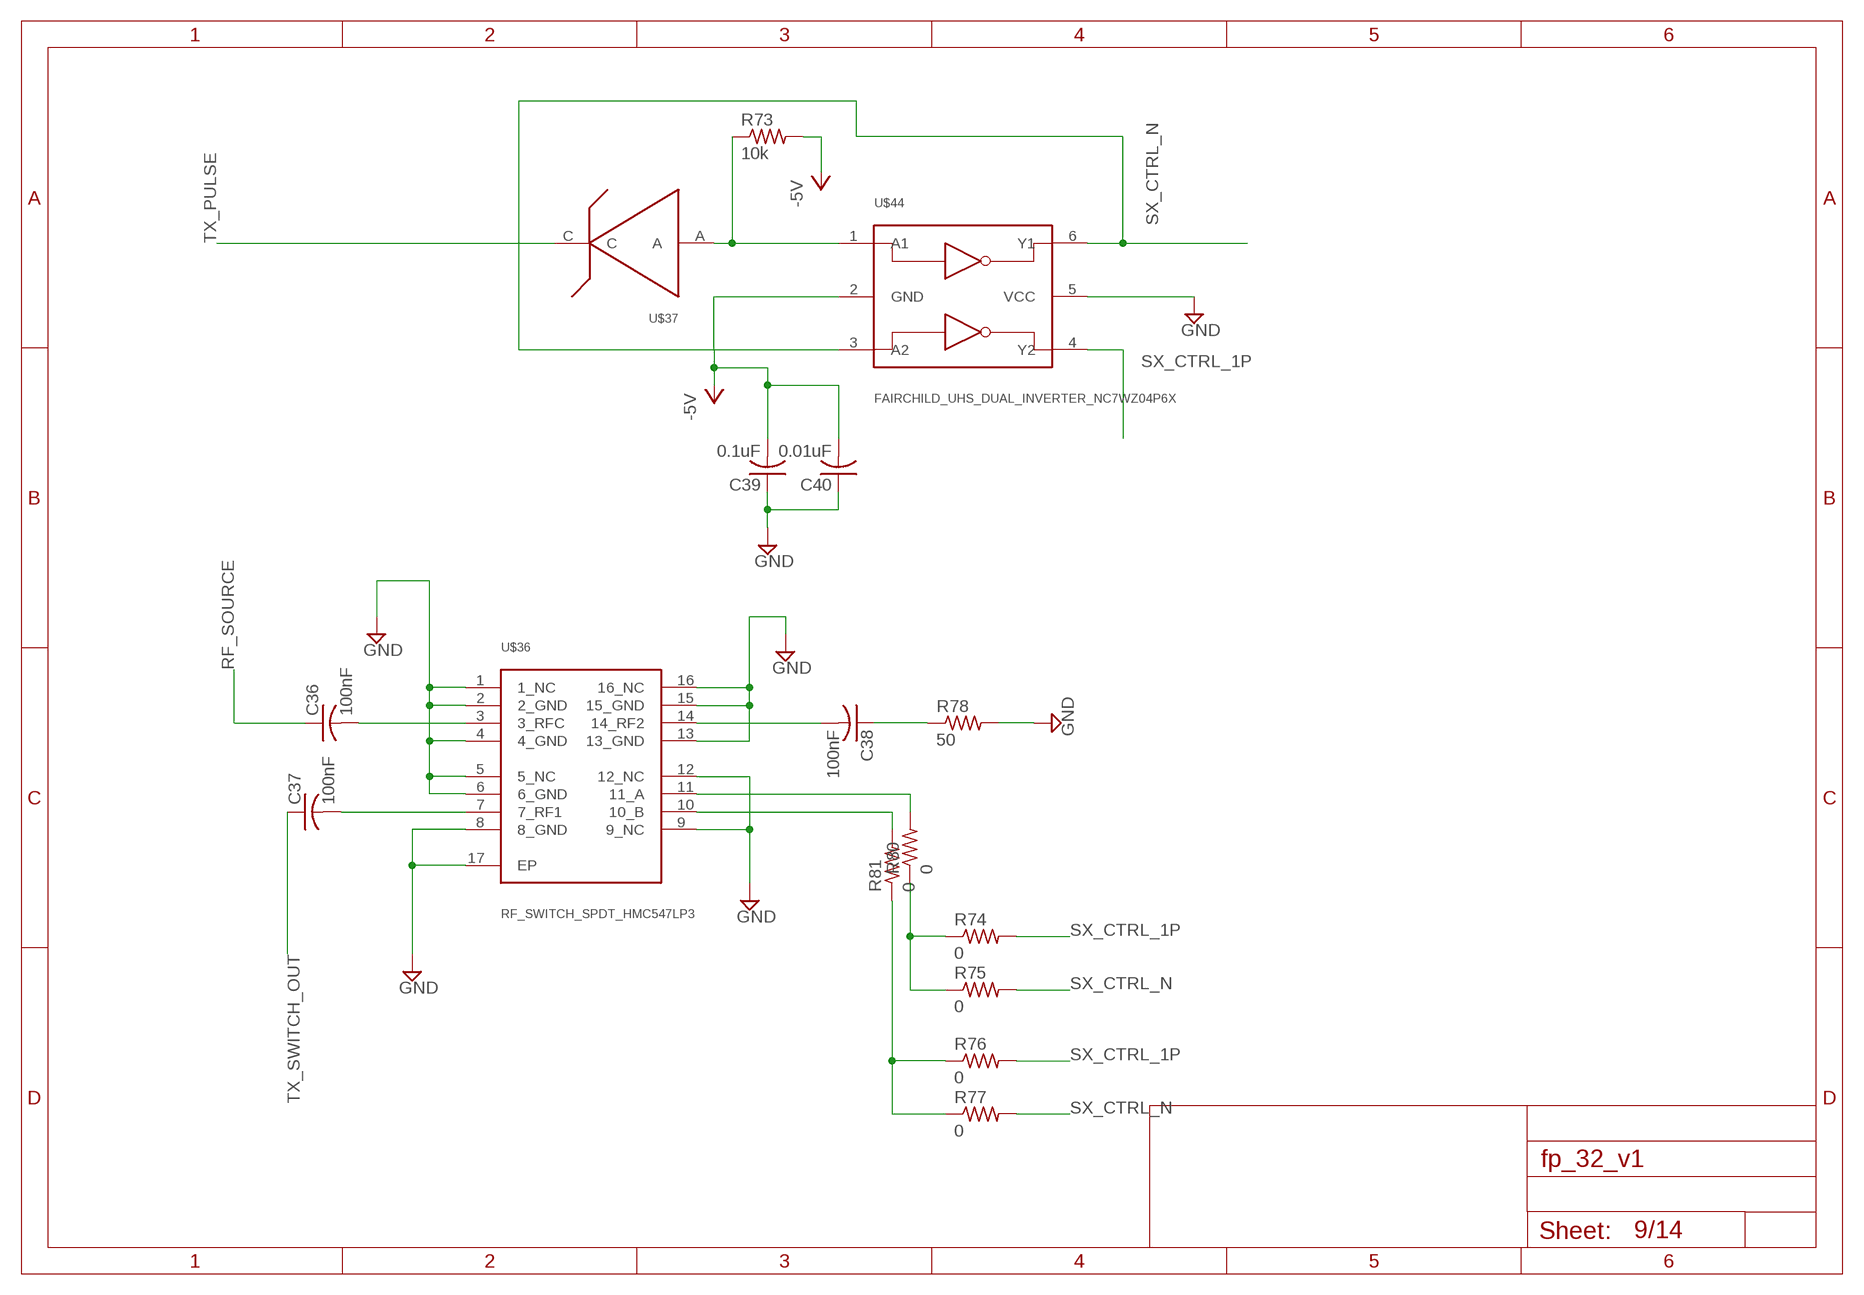
[diagram p8: schematic, sheet 9]

### Parts
C36  100nF  C-USC0603  [C0603]
C37  100nF  C-USC0603  [C0603]
C38  100nF  C-USC0603  [C0603]
C39  0.1uF  C-USC0603  [C0603]
C40  0.01uF  C-USC0603  [C0603]
R73  10k  R-US_R0603  [R0603]
R74  0  R-US_R0603  [R0603]
R75  0  R-US_R0603  [R0603]
R76  0  R-US_R0603  [R0603]
R77  0  R-US_R0603  [R0603]
R78  50  R-US_R0603  [R0603]
R80  0  R-US_R0603  [R0603]
R81  0  R-US_R0603  [R0603]
U$36  RF_SWITCH_SPDT_HMC547LP3  [CP_16_3]
U$37  ZENER_MMSZ4689-TP  [SOD123]
U$44  FAIRCHILD_UHS_DUAL_INVERTER_NC7WZ04P6X  [FAIRCHILD_DUAL_INVERTER_NC7WZ04P6X]

### Nets
-5V: C39.2 C40.2 R73.2 U$44.2(GND) ; also sheet 13
GND: C39.1 C40.1 R78.2 U$36.1(1_NC) U$36.2(2_GND) U$36.4(4_GND) U$36.5(5_NC) U$36.6(6_GND) U$36.8(8_GND) U$36.9(9_NC) U$36.12(12_NC) U$36.13(13_GND) U$36.15(15_GND) U$36.16(16_NC) U$36.17(EP) U$44.5(VCC) ; also sheet 1,2,3,4,5,6,7,8,10,11,12,13,14
N$16: C36.2 U$36.3(3_RFC)
N$17: C38.1 R78.1
N$19: C37.2 U$36.7(7_RF1)
N$20: C38.2 U$36.14(14_RF2)
N$21: R80.2 U$36.11(11_A)
N$22: R76.1 R77.1 R81.1
N$23: R73.1 U$37.A U$44.1(A1)
N$64: R81.2 U$36.10(10_B)
N$65: R74.1 R75.1 R80.1
RF_SOURCE: C36.1 ; also sheet 10
SX_CTRL_1P: R74.2 R76.2 U$44.4(Y2)
SX_CTRL_N: R75.2 R77.2 U$44.3(A2) U$44.6(Y1)
TX_PULSE: U$37.C ; also sheet 14
TX_SWITCH_OUT: C37.1 ; also sheet 11

## Sheet 10 of 14
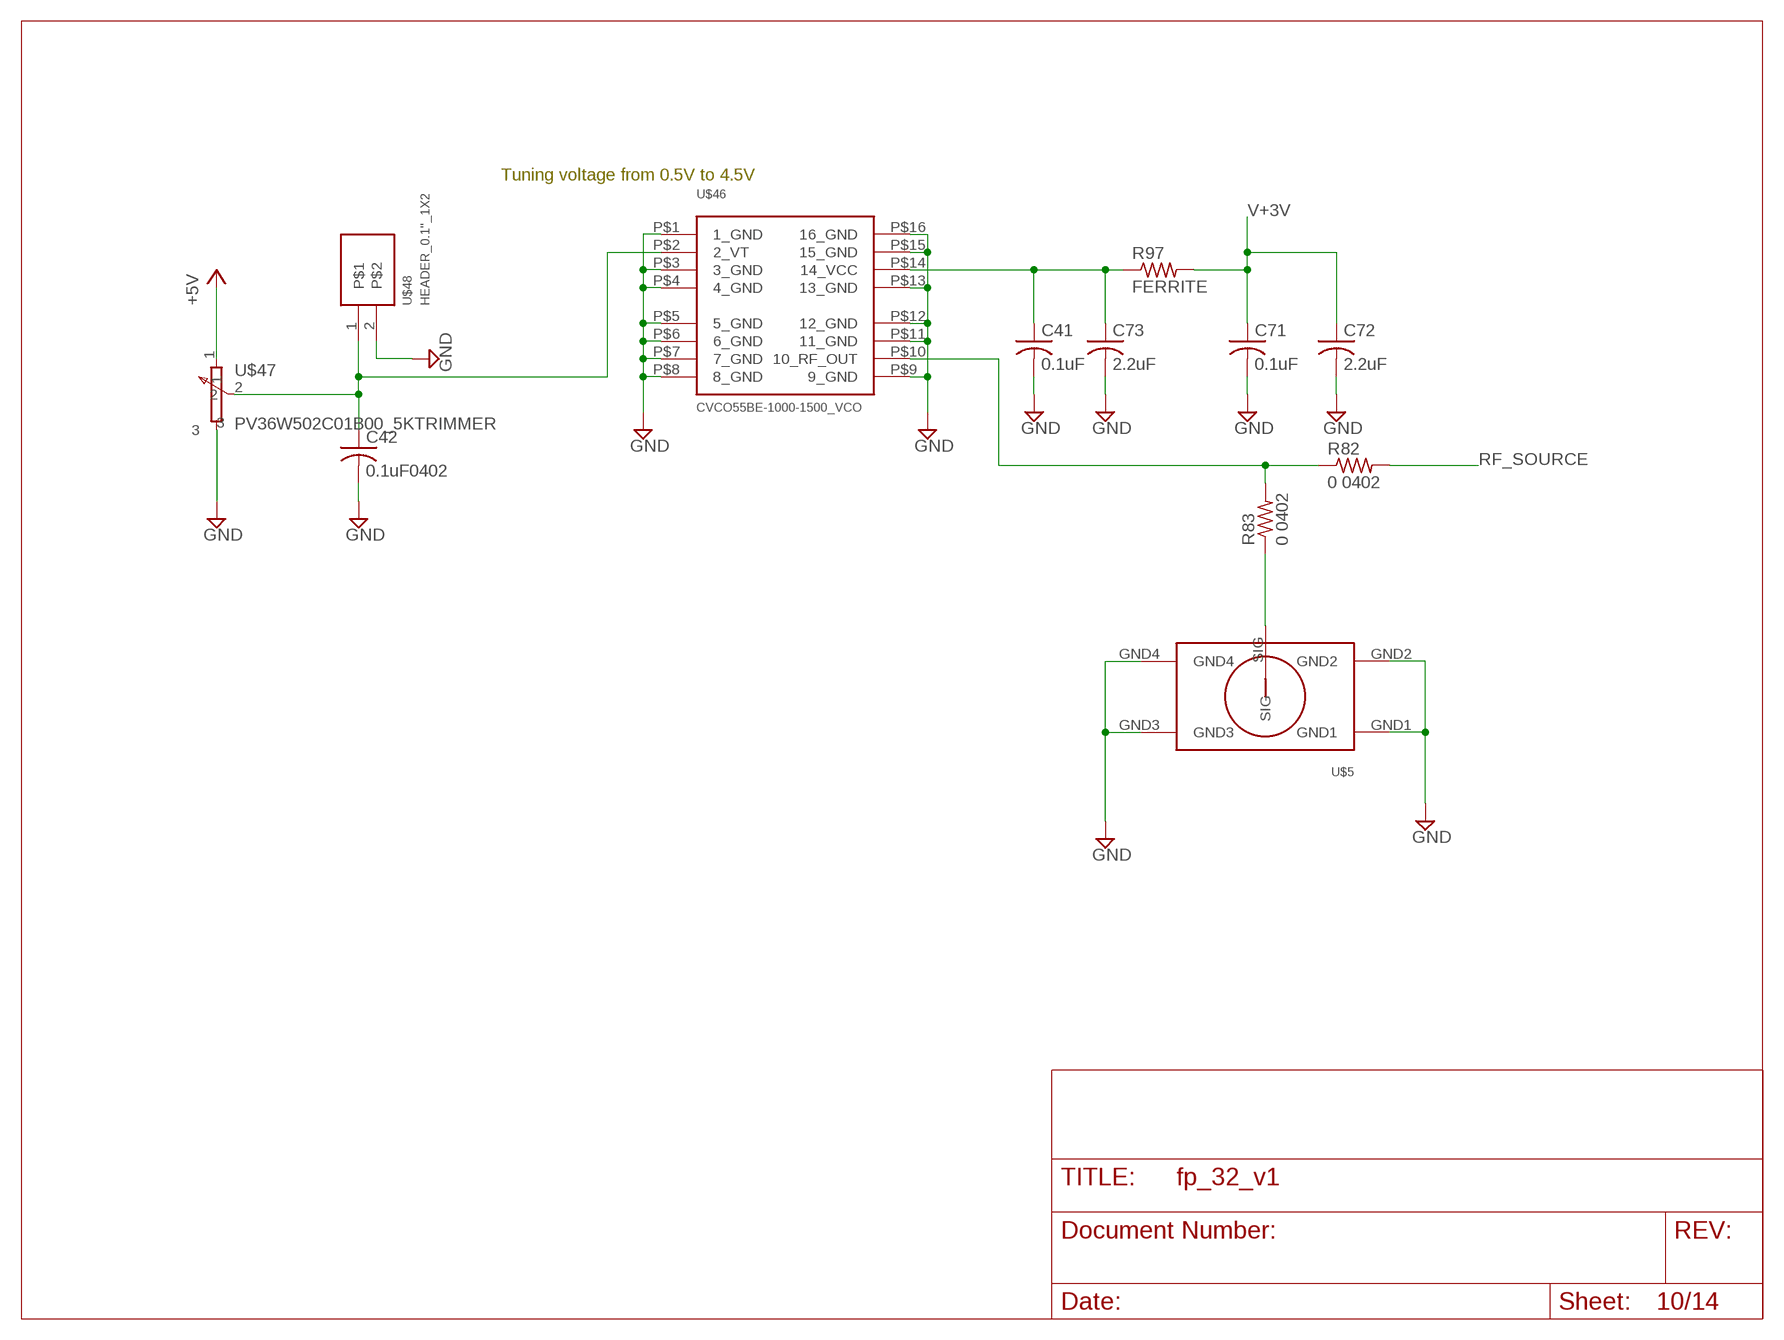
[diagram p9: schematic, sheet 10]

### Parts
C41  0.1uF  C-USC0603  [C0603]
C42  0.1uF0402  C-USC0402  [C0402]
C71  0.1uF  C-USC0603  [C0603]
C72  2.2uF  C-USC0603  [C0603]
C73  2.2uF  C-USC0603  [C0603]
R82  0 0402  R-US_R0402  [R0402]
R83  0 0402  R-US_R0402  [R0402]
R97  FERRITE  R-US_R0603  [R0603]
U$5  MINISMP_PE44970_THRUHOLE  [MINISMP_PE44970_THRU_HOLE]
U$46  CVCO55BE-1000-1500_VCO  [CVCO55BE-1000-1500_VCO]
U$47  PV36W502C01B00_5KTRIMMER  [PV36W502C01B00_5KTRIMMER]
U$48  HEADER_0.1''_1X2  [HEADER_0.1''_1X2]

### Nets
+5V: U$47.1 ; also sheet 6,11,12,13
GND: C41.2 C42.2 C71.2 C72.2 C73.2 U$5.GND1 U$5.GND2 U$5.GND3 U$5.GND4 U$46.P$1(1_GND) U$46.P$3(3_GND) U$46.P$4(4_GND) U$46.P$5(5_GND) U$46.P$6(6_GND) U$46.P$7(7_GND) U$46.P$8(8_GND) U$46.P$9(9_GND) U$46.P$11(11_GND) U$46.P$12(12_GND) U$46.P$13(13_GND) U$46.P$15(15_GND) U$46.P$16(16_GND) U$47.3 U$48.2 ; also sheet 1,2,3,4,5,6,7,8,9,11,12,13,14
N$25: C42.1 U$46.P$2(2_VT) U$47.2 U$48.1
N$26: R82.1 R83.2 U$46.P$10(10_RF_OUT)
N$27: R83.1 U$5.SIG
N$40: C41.1 C73.1 R97.1 U$46.P$14(14_VCC)
RF_SOURCE: R82.2 ; also sheet 9
V+3V: C71.1 C72.1 R97.2 ; also sheet 13

### Notes on the sheet
- Tuning voltage from 0.5V to 4.5V

## Sheet 11 of 14
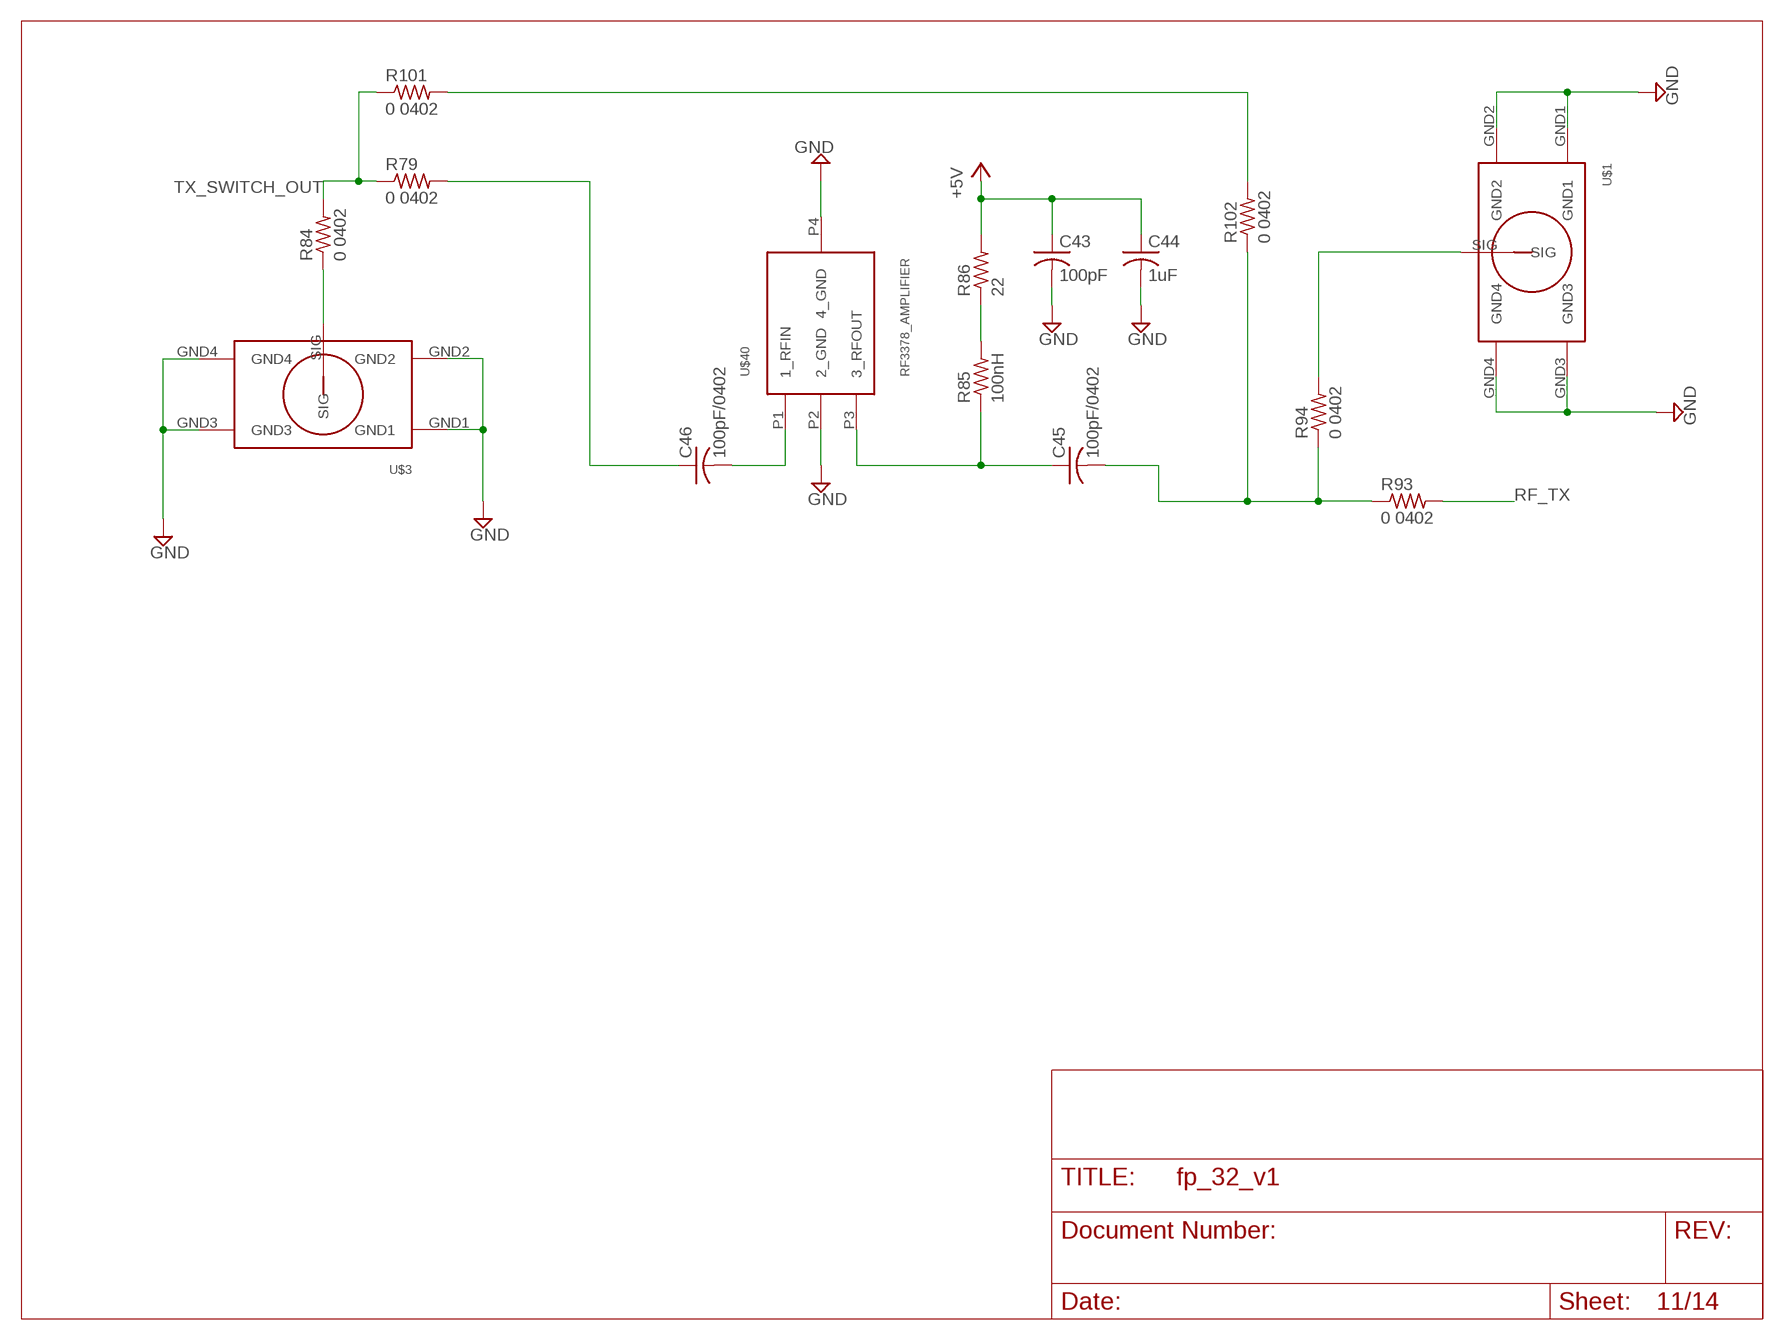
[diagram p10: schematic, sheet 11]

### Parts
C43  100pF  C-USC0603  [C0603]
C44  1uF  C-USC0603  [C0603]
C45  100pF/0402  C-USC0402  [C0402]
C46  100pF/0402  C-USC0402  [C0402]
R79  0 0402  R-US_R0402  [R0402]
R84  0 0402  R-US_R0402  [R0402]
R85  100nH  R-US_R0603  [R0603]
R86  22  R-US_R0805  [R0805]
R93  0 0402  R-US_R0402  [R0402]
R94  0 0402  R-US_R0402  [R0402]
R101  0 0402  R-US_R0402  [R0402]
R102  0 0402  R-US_R0402  [R0402]
U$1  MINISMP_PE44970_THRUHOLE  [MINISMP_PE44970_THRU_HOLE]
U$3  MINISMP_PE44970_THRUHOLE  [MINISMP_PE44970_THRU_HOLE]
U$40  RF3378_AMPLIFIER  [TO243AA/SOT89]

### Nets
+5V: C43.1 C44.1 R86.2 ; also sheet 6,10,12,13
GND: C43.2 C44.2 U$1.GND1 U$1.GND2 U$1.GND3 U$1.GND4 U$3.GND1 U$3.GND2 U$3.GND3 U$3.GND4 U$40.P2(2_GND) U$40.P4(4_GND) ; also sheet 1,2,3,4,5,6,7,8,9,10,12,13,14
N$3: R94.2 U$1.SIG
N$8: R84.1 U$3.SIG
N$24: C45.1 R85.1 U$40.P3(3_RFOUT)
N$28: R85.2 R86.1
N$29: C46.2 U$40.P1(1_RFIN)
N$30: C45.2 R93.1 R94.1 R102.1
N$31: C46.1 R79.2
N$43: R101.2 R102.2
RF_TX: R93.2 ; also sheet 5
TX_SWITCH_OUT: R79.1 R84.2 R101.1 ; also sheet 9

## Sheet 12 of 14
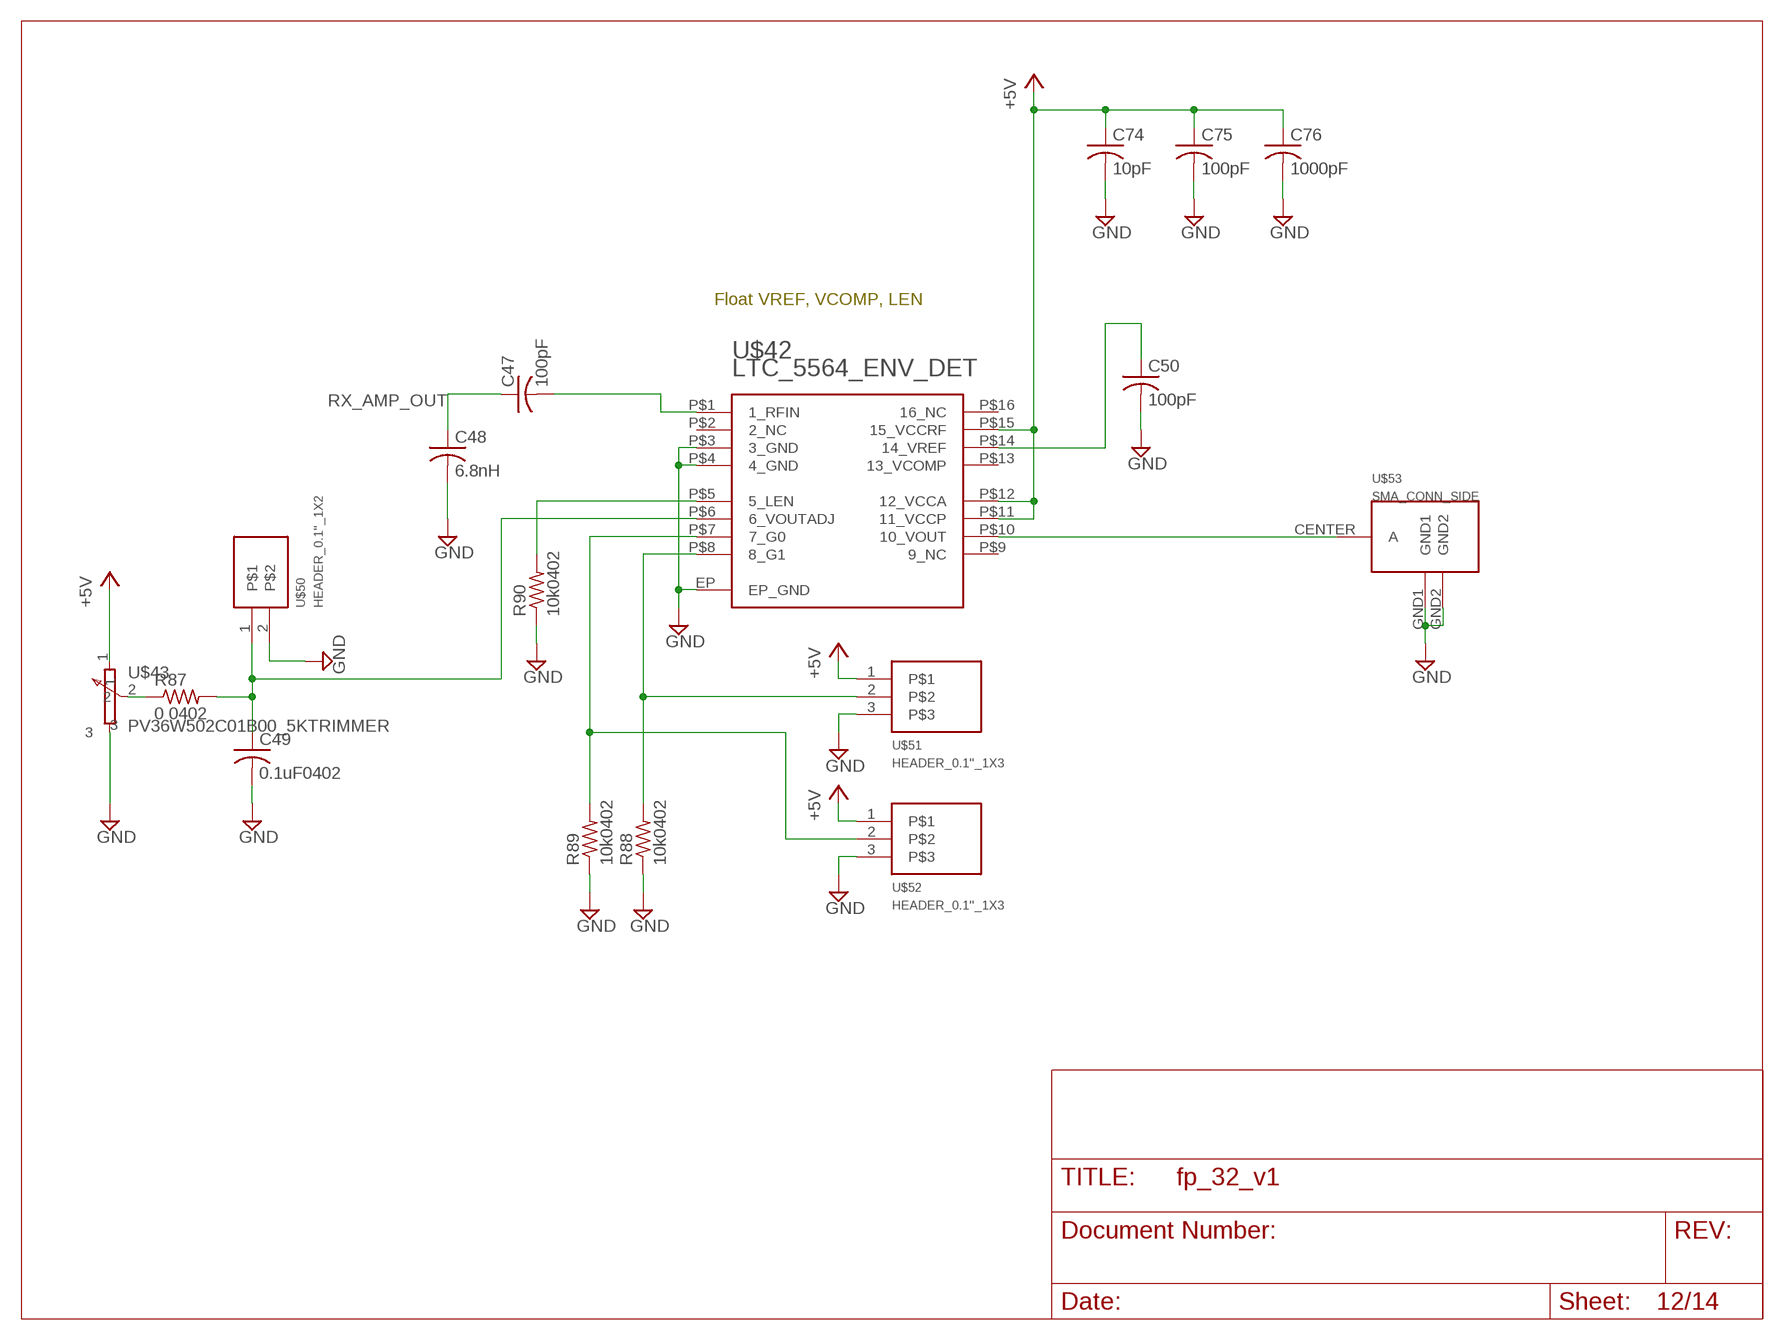
[diagram p11: schematic, sheet 12]

### Parts
C47  100pF  C-USC0402  [C0402]
C48  6.8nH  C-USC0402  [C0402]
C49  0.1uF0402  C-USC0402  [C0402]
C50  100pF  C-USC0402  [C0402]
C74  10pF  C-USC0402  [C0402]
C75  100pF  C-USC0402  [C0402]
C76  1000pF  C-USC0402  [C0402]
R87  0 0402  R-US_R0402  [R0402]
R88  10k0402  R-US_R0402  [R0402]
R89  10k0402  R-US_R0402  [R0402]
R90  10k0402  R-US_R0402  [R0402]
U$42  LTC_5564_ENV_DET  [QFN16]
U$43  PV36W502C01B00_5KTRIMMER  [PV36W502C01B00_5KTRIMMER]
U$50  HEADER_0.1''_1X2  [HEADER_0.1''_1X2]
U$51  HEADER_0.1''_1X3  [HEADER_0.1''_1X3]
U$52  HEADER_0.1''_1X3  [HEADER_0.1''_1X3]
U$53  SMA_CONN_SIDE  [SMA_CONN_SIDE]

### Nets
+5V: C74.1 C75.1 C76.1 U$42.P$11(11_VCCP) U$42.P$12(12_VCCA) U$42.P$15(15_VCCRF) U$43.1 U$51.1 U$52.1 ; also sheet 6,10,11,13
GND: C48.2 C49.2 C50.2 C74.2 C75.2 C76.2 R88.1 R89.1 R90.1 U$42.EP(EP_GND) U$42.P$3(3_GND) U$42.P$4(4_GND) U$43.3 U$50.2 U$51.3 U$52.3 U$53.GND1 U$53.GND2 ; also sheet 1,2,3,4,5,6,7,8,9,10,11,13,14
N$32: C47.2 U$42.P$1(1_RFIN)
N$34: C49.1 R87.2 U$42.P$6(6_VOUTADJ) U$50.1
N$35: R87.1 U$43.2
N$36: C50.1 U$42.P$14(14_VREF)
N$37: R88.2 U$42.P$8(8_G1) U$51.2
N$38: R89.2 U$42.P$7(7_G0) U$52.2
N$39: R90.2 U$42.P$5(5_LEN)
N$41: U$42.P$10(10_VOUT) U$53.CENTER(A)
RX_AMP_OUT: C47.1 C48.1 ; also sheet 6
Unconnected: U$42.P$2(2_NC) U$42.P$9(9_NC) U$42.P$13(13_VCOMP) U$42.P$16(16_NC)

### Notes on the sheet
- Float VREF, VCOMP, LEN

## Sheet 13 of 14
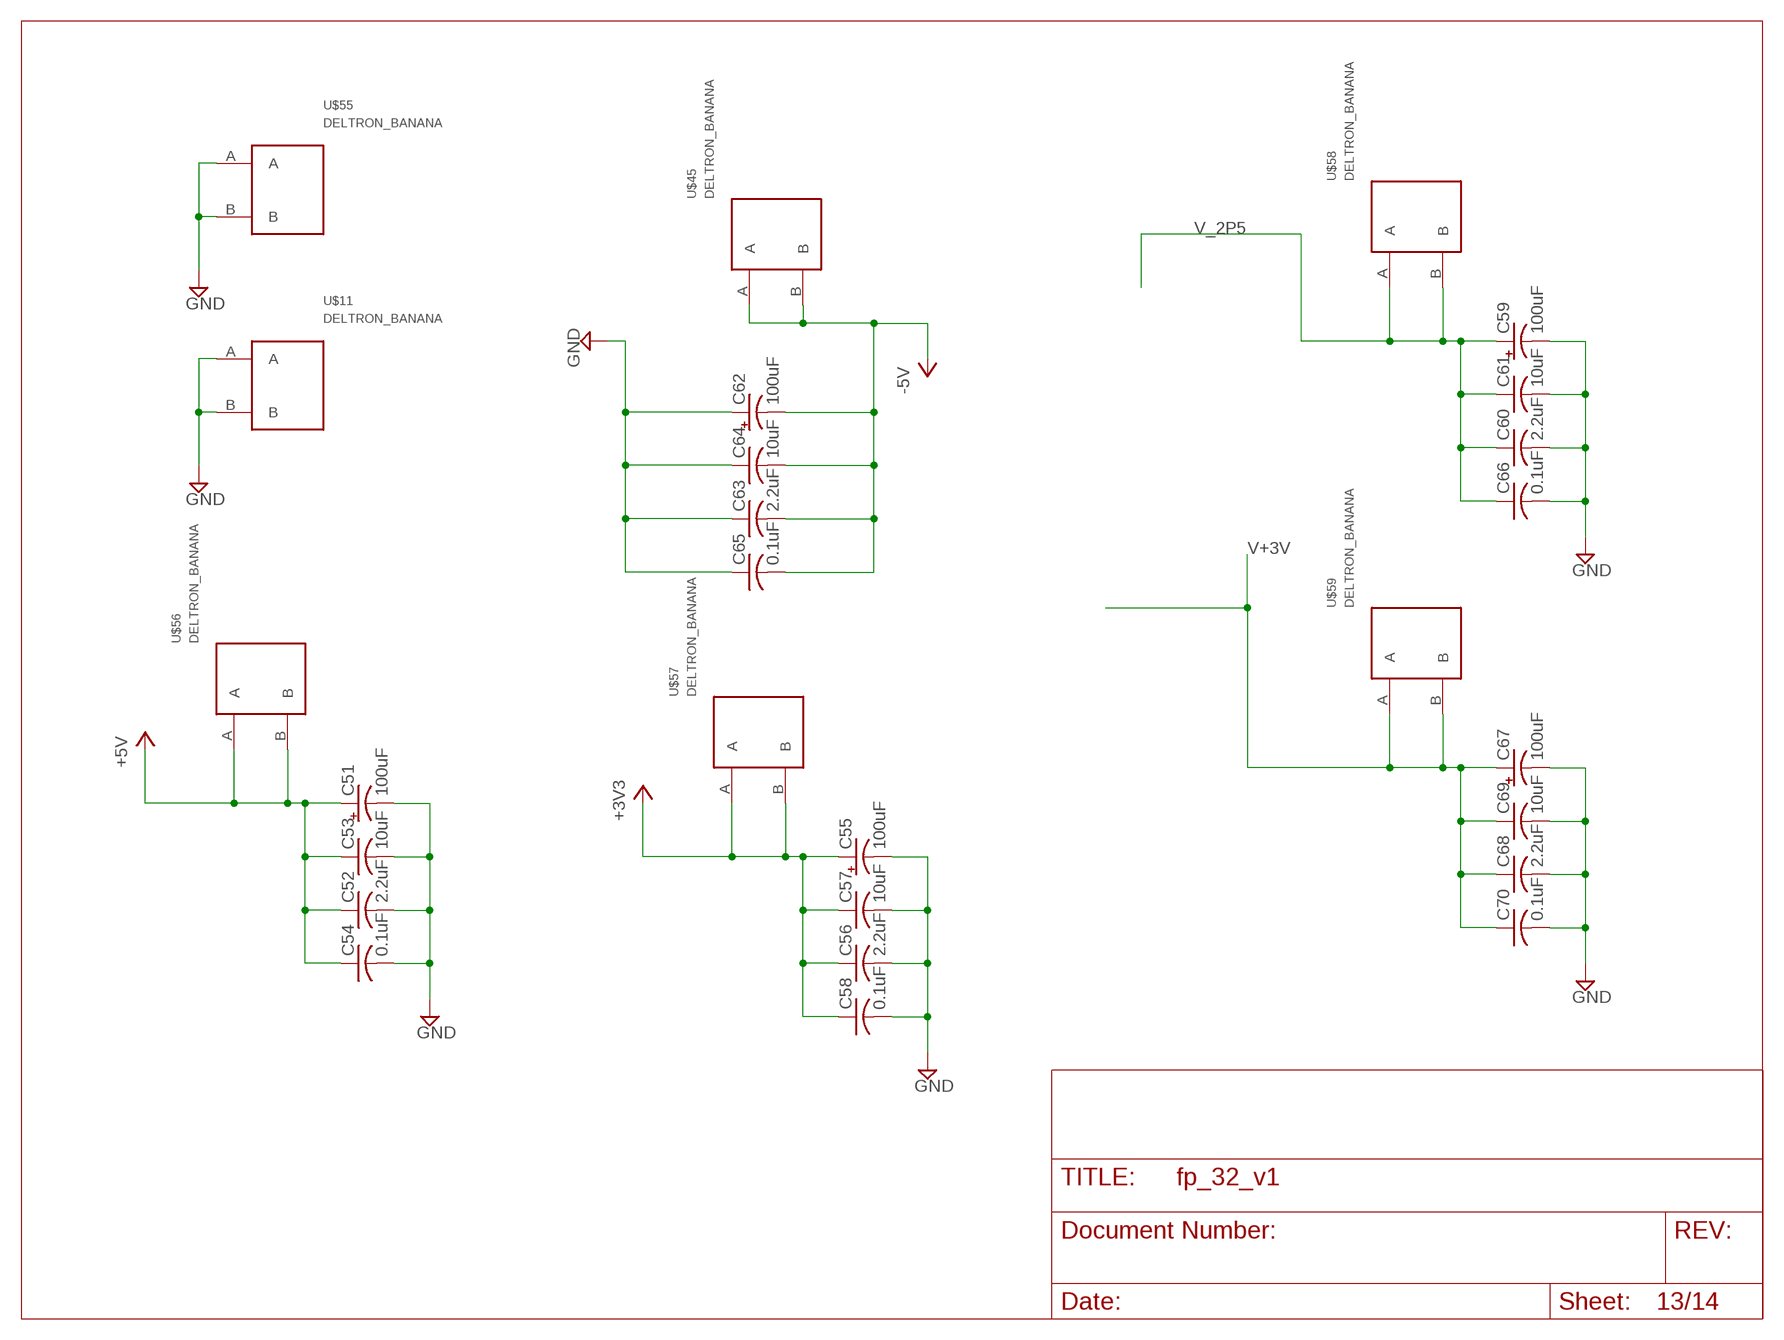
[diagram p12: schematic, sheet 13]

### Parts
C51  100uF  CAP_POL_DEV  [CAP_POL_RADIAL_8MM_3P5MMPAD]
C52  2.2uF  C-USC0603  [C0603]
C53  10uF  C-USC1206  [C1206]
C54  0.1uF  C-USC0603  [C0603]
C55  100uF  CAP_POL_DEV  [CAP_POL_RADIAL_8MM_3P5MMPAD]
C56  2.2uF  C-USC0603  [C0603]
C57  10uF  C-USC1206  [C1206]
C58  0.1uF  C-USC0603  [C0603]
C59  100uF  CAP_POL_DEV  [CAP_POL_RADIAL_8MM_3P5MMPAD]
C60  2.2uF  C-USC0603  [C0603]
C61  10uF  C-USC1206  [C1206]
C62  100uF  CAP_POL_DEV  [CAP_POL_RADIAL_8MM_3P5MMPAD]
C63  2.2uF  C-USC0603  [C0603]
C64  10uF  C-USC1206  [C1206]
C65  0.1uF  C-USC0603  [C0603]
C66  0.1uF  C-USC0603  [C0603]
C67  100uF  CAP_POL_DEV  [CAP_POL_RADIAL_8MM_3P5MMPAD]
C68  2.2uF  C-USC0603  [C0603]
C69  10uF  C-USC1206  [C1206]
C70  0.1uF  C-USC0603  [C0603]
U$11  DELTRON_BANANA  [DELTRON_BANANA]
U$45  DELTRON_BANANA  [DELTRON_BANANA]
U$55  DELTRON_BANANA  [DELTRON_BANANA]
U$56  DELTRON_BANANA  [DELTRON_BANANA]
U$57  DELTRON_BANANA  [DELTRON_BANANA]
U$58  DELTRON_BANANA  [DELTRON_BANANA]
U$59  DELTRON_BANANA  [DELTRON_BANANA]

### Nets
+3V3: C55.PIN+ C56.1 C57.1 C58.1 U$57.A U$57.B ; also sheet 5,6,7,8
+5V: C51.PIN+ C52.1 C53.1 C54.1 U$56.A U$56.B ; also sheet 6,10,11,12
-5V: C62.PIN- C63.2 C64.2 C65.2 U$45.A U$45.B ; also sheet 9
GND: C51.PIN- C52.2 C53.2 C54.2 C55.PIN- C56.2 C57.2 C58.2 C59.PIN- C60.2 C61.2 C62.PIN+ C63.1 C64.1 C65.1 C66.2 C67.PIN- C68.2 C69.2 C70.2 U$11.A U$11.B U$55.A U$55.B ; also sheet 1,2,3,4,5,6,7,8,9,10,11,12,14
V+3V: C67.PIN+ C68.1 C69.1 C70.1 U$59.A U$59.B ; also sheet 10
V_2P5: C59.PIN+ C60.1 C61.1 C66.1 U$58.A U$58.B ; also sheet 1,2,3,4,5

## Sheet 14 of 14
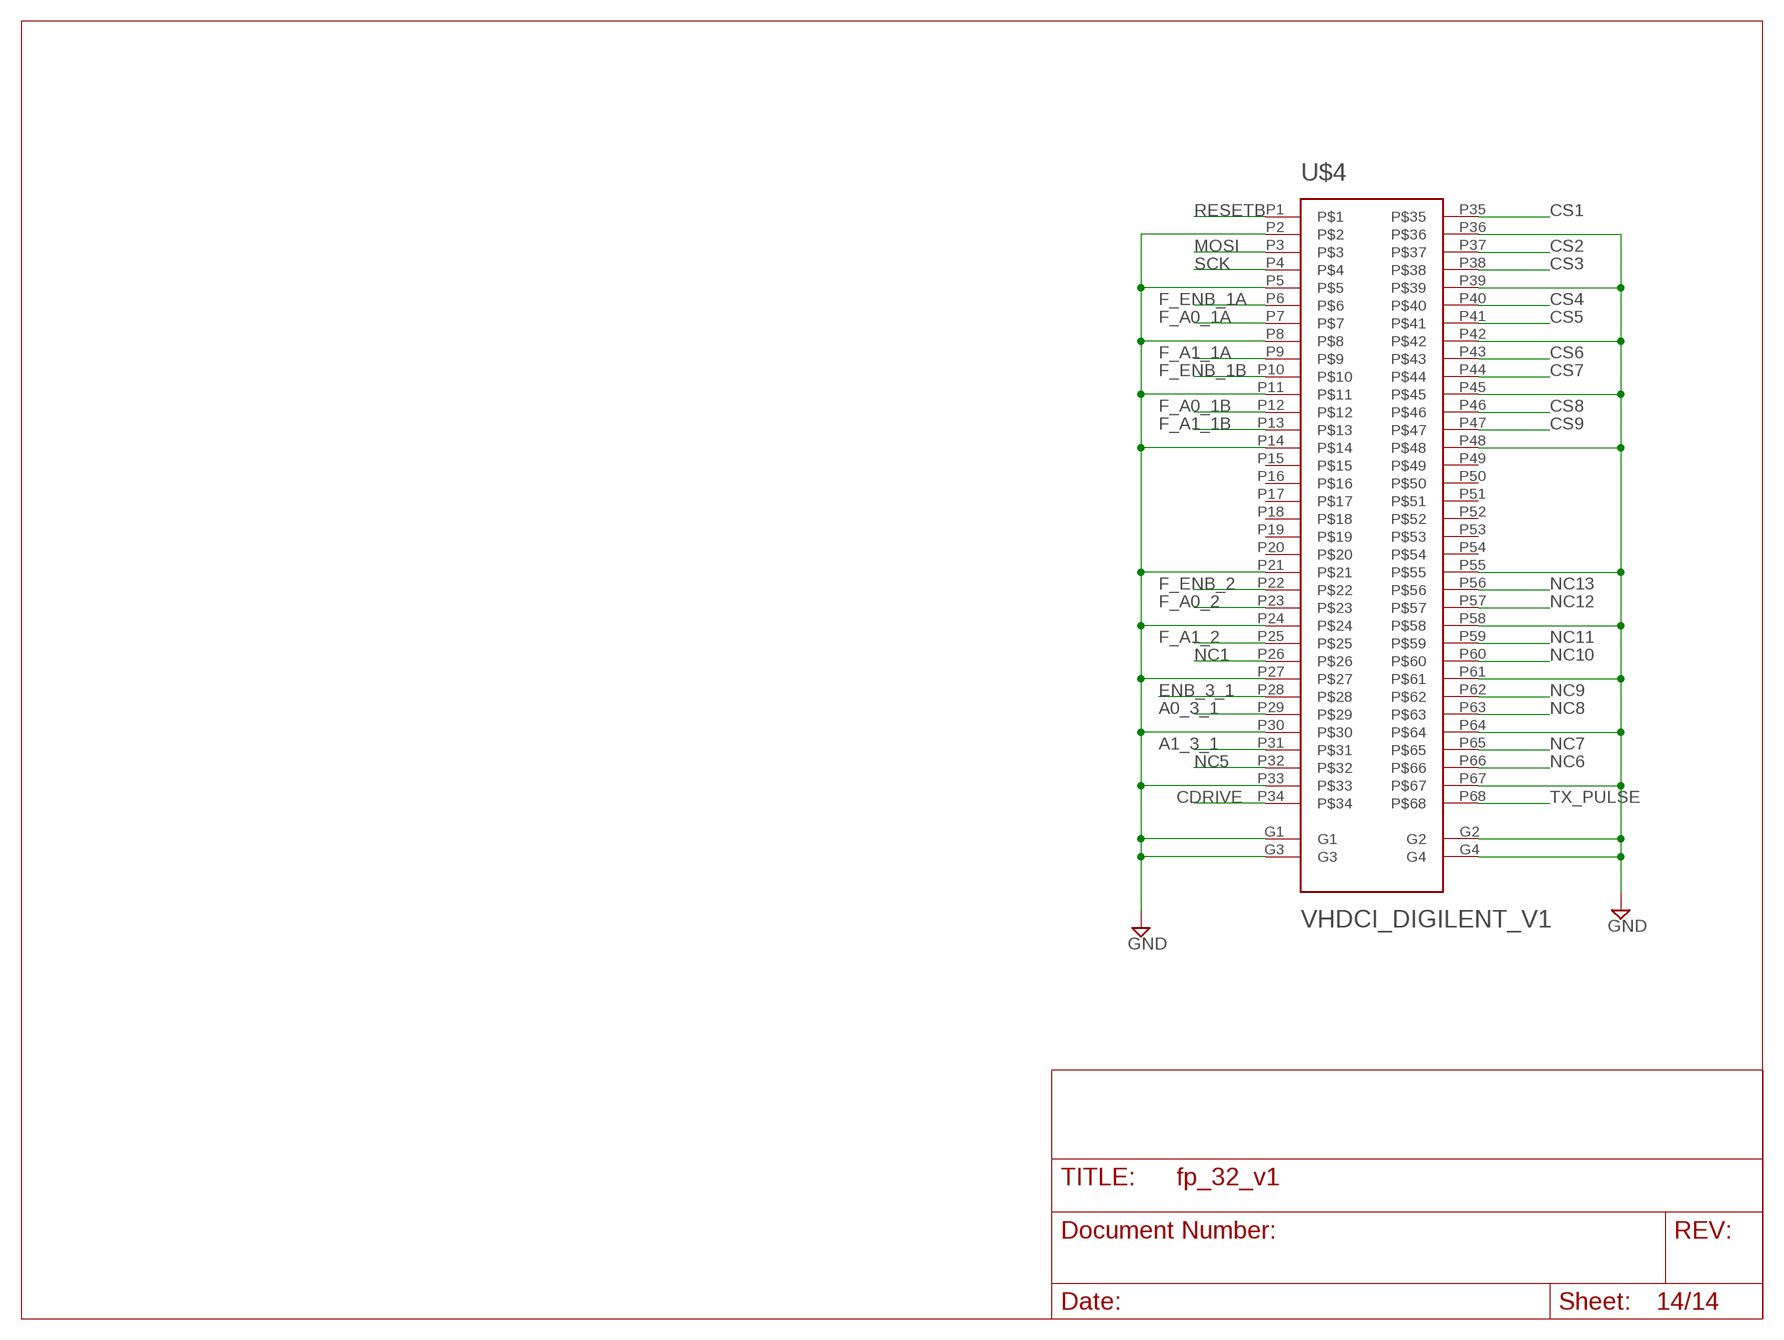
[diagram p13: schematic, sheet 14]

### Parts
U$4  VHDCI_DIGILENT_V1  [VHCDI_DIGILENT_V1]

### Nets
A0_3_1: U$4.P29 ; also sheet 5
A1_3_1: U$4.P31 ; also sheet 5
CDRIVE: U$4.P34 ; also sheet 5
CS1: U$4.P35 ; also sheet 5
CS2: U$4.P37 ; also sheet 5
CS3: U$4.P38 ; also sheet 6
CS4: U$4.P40 ; also sheet 7
CS5: U$4.P41 ; also sheet 7
CS6: U$4.P43 ; also sheet 7
CS7: U$4.P44 ; also sheet 8
CS8: U$4.P46 ; also sheet 8
CS9: U$4.P47 ; also sheet 8
ENB_3_1: U$4.P28 ; also sheet 5
F_A0_1A: U$4.P7 ; also sheet 5
F_A0_1B: U$4.P12 ; also sheet 5
F_A0_2: U$4.P23 ; also sheet 6
F_A1_1A: U$4.P9 ; also sheet 7
F_A1_1B: U$4.P13 ; also sheet 7
F_A1_2: U$4.P25 ; also sheet 7
F_ENB_1A: U$4.P6 ; also sheet 8
F_ENB_1B: U$4.P10 ; also sheet 8
F_ENB_2: U$4.P22 ; also sheet 8
GND: U$4.G1 U$4.G2 U$4.G3 U$4.G4 U$4.P2 U$4.P5 U$4.P8 U$4.P11 U$4.P14 U$4.P21 U$4.P24 U$4.P27 U$4.P30 U$4.P33 U$4.P36 U$4.P39 U$4.P42 U$4.P45 U$4.P48 U$4.P55 U$4.P58 U$4.P61 U$4.P64 U$4.P67 ; also sheet 1,2,3,4,5,6,7,8,9,10,11,12,13
MOSI: U$4.P3 ; also sheet 5,6,7,8
NC1: U$4.P26
NC5: U$4.P32
NC6: U$4.P66
NC7: U$4.P65
NC8: U$4.P63
NC9: U$4.P62
NC10: U$4.P60
NC11: U$4.P59
NC12: U$4.P57
NC13: U$4.P56
RESETB: U$4.P1 ; also sheet 5,6,7,8
SCK: U$4.P4 ; also sheet 5,6,7,8
TX_PULSE: U$4.P68 ; also sheet 9
Unconnected: U$4.P15 U$4.P16 U$4.P17 U$4.P18 U$4.P19 U$4.P20 U$4.P49 U$4.P50 U$4.P51 U$4.P52 U$4.P53 U$4.P54

## Library data of the parts
C1-C50 C52-C54 C56-C58 C60 C61 C63-C66 C68-C76 = rcl:C-US: CAPACITOR, American symbol
C51 C55 C59 C62 C67 = RF_servo_SA032212:CAP_POL_DEV: Polarized Capacitor Created on : 03.24.2012 Created by: Serhan Ardanuc
R1-R102 = rcl:R-US_: RESISTOR, American symbol
U1-U9 = ticLib4:ADG738BRUZ
U$1 U$3 U$5-U$7 = ticLib4:MINISMP_PE44970_THRUHOLE
U$2 U$17 U$23 U$29 = FP_BOARD_V3 (1):FP-BOND-6MIL
U$4 = tic_testing:VHDCI_DIGILENT_V1
U$8 U$13-U$15 U$18-U$22 U$24-U$28 U$30-U$35 = FP_BOARD_V3 (1):TICLIB2_ADG904
U$9 = FP_BOARD_V3 (1):TIC_TESTING_ADG918BRMZ-500RL7CT
U$10 U$40 = ticLib4:RF3378_AMPLIFIER
U$11 U$45 U$55-U$59 = tic_lib_3:DELTRON_BANANA
U$16 = FP_BOARD_V3 (1):TICLIB2_ADG904; SPICEPREFIX: X
U$36 = ticLib2:RF_SWITCH_SPDT_HMC547LP3
U$37 = ticLib2:ZENER_MMSZ4689-TP
U$42 = ticLib4:LTC_5564_ENV_DET
U$43 U$47 = blood_viscosity_lib_1:PV36W502C01B00_5KTRIMMER
U$44 = tic_testing:FAIRCHILD_UHS_DUAL_INVERTER_NC7WZ04P6X
U$46 = ticLib4:CVCO55BE-1000-1500_VCO
U$48 U$50 = tic_testing:HEADER_0.1''_1X2
U$51 U$52 = tic_testing:HEADER_0.1''_1X3
U$53 = ticLib2:SMA_CONN_SIDE